# EAGLE design v0.2 (EAGLE 8.4.3)
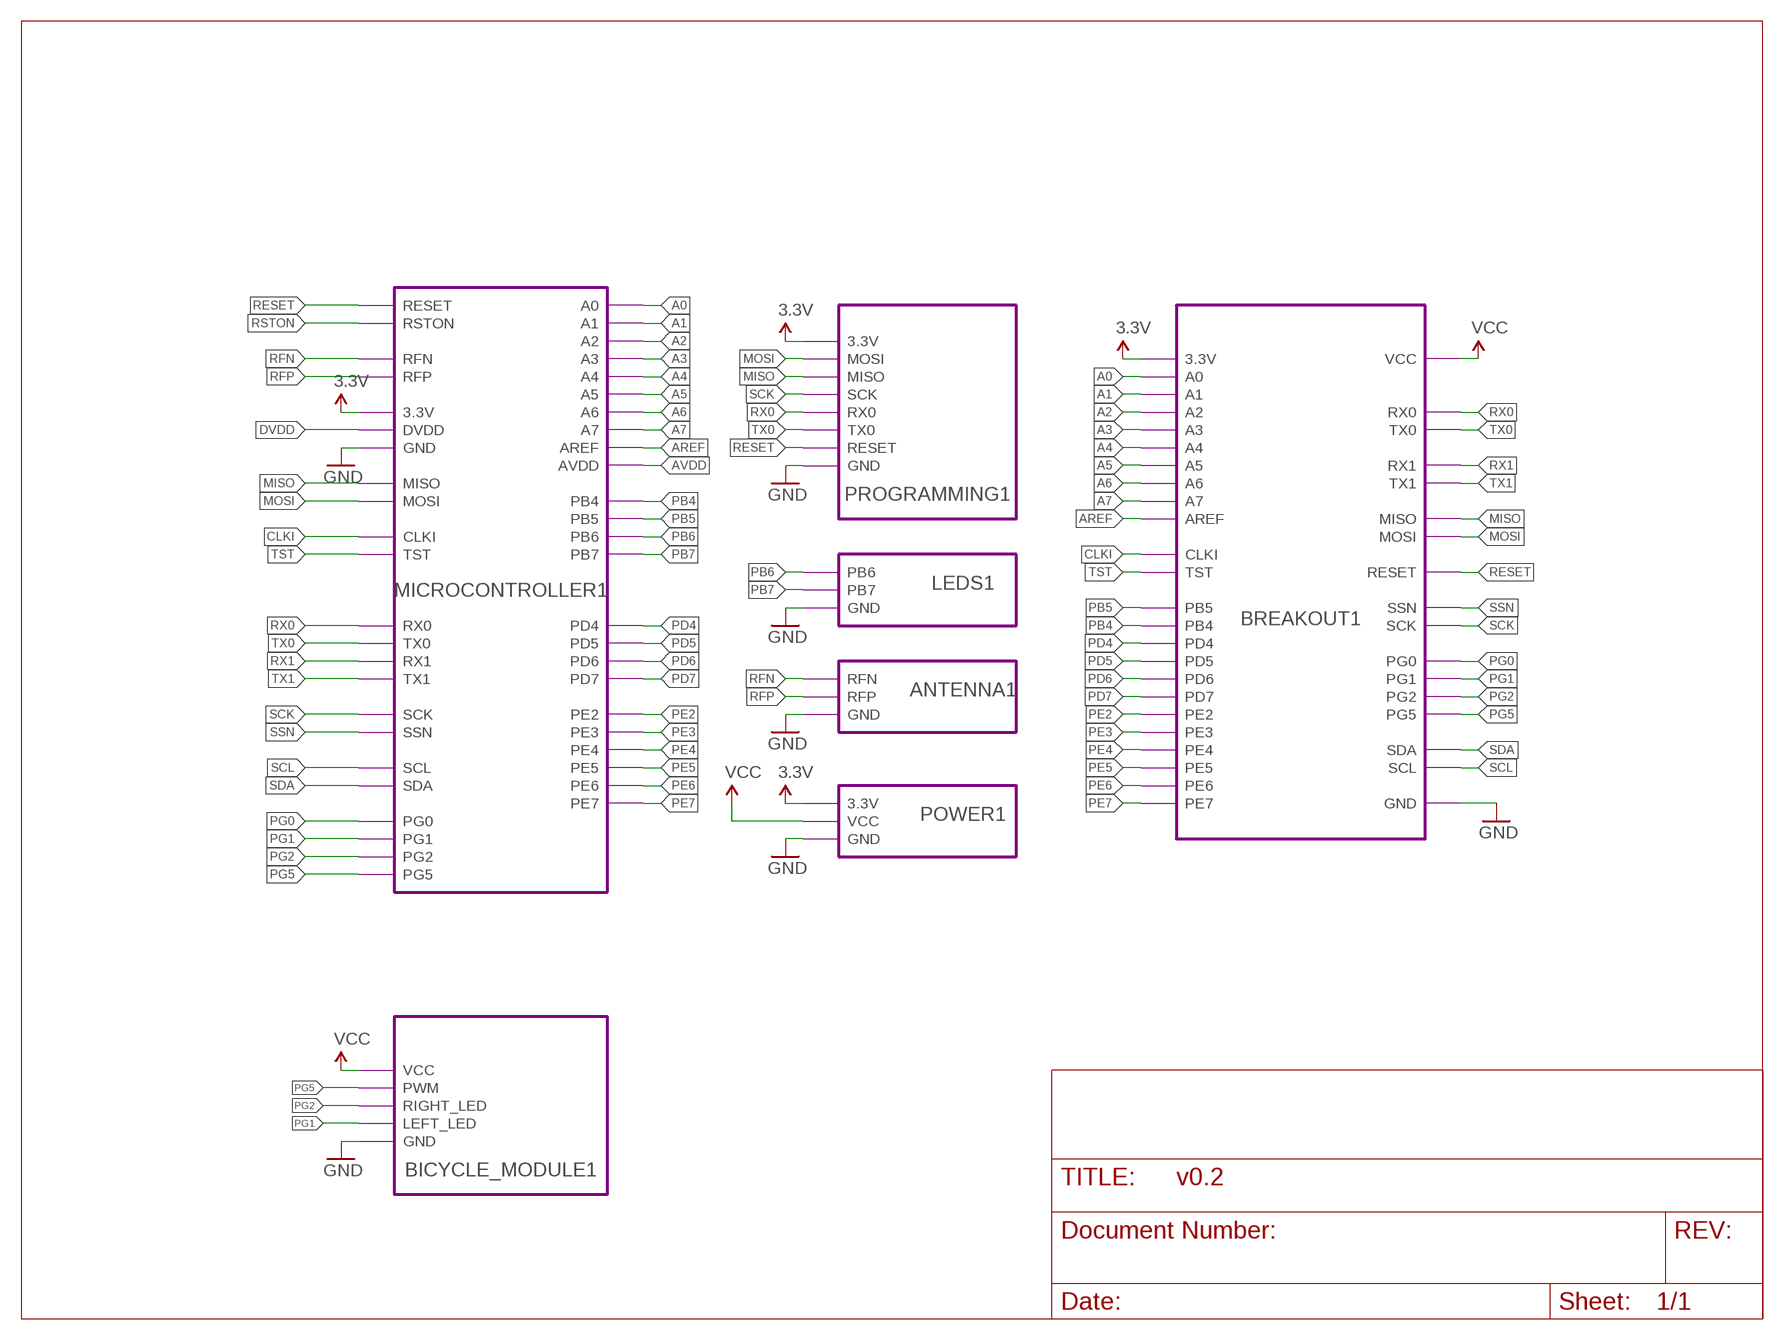
[diagram p0: schematic, sheet 1]

## Module instances
MICROCONTROLLER1 = MICROCONTROLLER
LEDS1 = LEDS
BREAKOUT1 = BREAKOUTS
ANTENNA1 = ANTENNA
POWER1 = POWER
PROGRAMMING1 = PROGRAMMING
BICYCLE_MODULE1 = BICYCLE_MODULE

## Nets
3.3V: port MICROCONTROLLER1.3.3V PROGRAMMING1.3.3V POWER1.3.3V BREAKOUT1.3.3V
A0: port MICROCONTROLLER1.A0 BREAKOUT1.A0
A1: port MICROCONTROLLER1.A1 BREAKOUT1.A1
A2: port MICROCONTROLLER1.A2 BREAKOUT1.A2
A3: port MICROCONTROLLER1.A3 BREAKOUT1.A3
A4: port MICROCONTROLLER1.A4 BREAKOUT1.A4
A5: port MICROCONTROLLER1.A5 BREAKOUT1.A5
A6: port MICROCONTROLLER1.A6 BREAKOUT1.A6
A7: port MICROCONTROLLER1.A7 BREAKOUT1.A7
AREF: port MICROCONTROLLER1.AREF BREAKOUT1.AREF
AVDD: port MICROCONTROLLER1.AVDD
CLKI: port MICROCONTROLLER1.CLKI BREAKOUT1.CLKI
DVDD: port MICROCONTROLLER1.DVDD
GND: port PROGRAMMING1.GND LEDS1.GND ANTENNA1.GND POWER1.GND MICROCONTROLLER1.GND BREAKOUT1.GND BICYCLE_MODULE1.GND
MISO: port PROGRAMMING1.MISO MICROCONTROLLER1.MISO BREAKOUT1.MISO
MOSI: port MICROCONTROLLER1.MOSI PROGRAMMING1.MOSI BREAKOUT1.MOSI
PB4: port MICROCONTROLLER1.PB4 BREAKOUT1.PB4
PB5: port MICROCONTROLLER1.PB5 BREAKOUT1.PB5
PB6: port MICROCONTROLLER1.PB6 LEDS1.PB6
PB7: port MICROCONTROLLER1.PB7 LEDS1.PB7
PD4: port MICROCONTROLLER1.PD4 BREAKOUT1.PD4
PD5: port MICROCONTROLLER1.PD5 BREAKOUT1.PD5
PD6: port MICROCONTROLLER1.PD6 BREAKOUT1.PD6
PD7: port MICROCONTROLLER1.PD7 BREAKOUT1.PD7
PE2: port MICROCONTROLLER1.PE2 BREAKOUT1.PE2
PE3: port MICROCONTROLLER1.PE3 BREAKOUT1.PE3
PE4: port MICROCONTROLLER1.PE4 BREAKOUT1.PE4
PE5: port MICROCONTROLLER1.PE5 BREAKOUT1.PE5
PE6: port MICROCONTROLLER1.PE6 BREAKOUT1.PE6
PE7: port MICROCONTROLLER1.PE7 BREAKOUT1.PE7
PG0: port MICROCONTROLLER1.PG0 BREAKOUT1.PG0
PG1: port MICROCONTROLLER1.PG1 BREAKOUT1.PG1 BICYCLE_MODULE1.LEFT_LED
PG2: port MICROCONTROLLER1.PG2 BREAKOUT1.PG2 BICYCLE_MODULE1.RIGHT_LED
PG5: port MICROCONTROLLER1.PG5 BREAKOUT1.PG5 BICYCLE_MODULE1.PWM
RESET: port MICROCONTROLLER1.RESET PROGRAMMING1.RESET BREAKOUT1.RESET
RFN: port MICROCONTROLLER1.RFN ANTENNA1.RFN
RFP: port MICROCONTROLLER1.RFP ANTENNA1.RFP
RSTON: port MICROCONTROLLER1.RSTON
RX0: port MICROCONTROLLER1.RX0 PROGRAMMING1.RX0 BREAKOUT1.RX0
RX1: port MICROCONTROLLER1.RX1 BREAKOUT1.RX1
SCK: port MICROCONTROLLER1.SCK PROGRAMMING1.SCK BREAKOUT1.SCK
SCL: port MICROCONTROLLER1.SCL BREAKOUT1.SCL
SDA: port MICROCONTROLLER1.SDA BREAKOUT1.SDA
SSN: port MICROCONTROLLER1.SSN BREAKOUT1.SSN
TST: port MICROCONTROLLER1.TST BREAKOUT1.TST
TX0: port MICROCONTROLLER1.TX0 PROGRAMMING1.TX0 BREAKOUT1.TX0
TX1: port MICROCONTROLLER1.TX1 BREAKOUT1.TX1
VCC: port BREAKOUT1.VCC POWER1.VCC BICYCLE_MODULE1.VCC

## Library data of the parts

## Module PROGRAMMING
Ports: RESET(io) SCK(io) MISO(io) MOSI(io) RX0(io) 3.3V(io) TX0(io) GND(io)
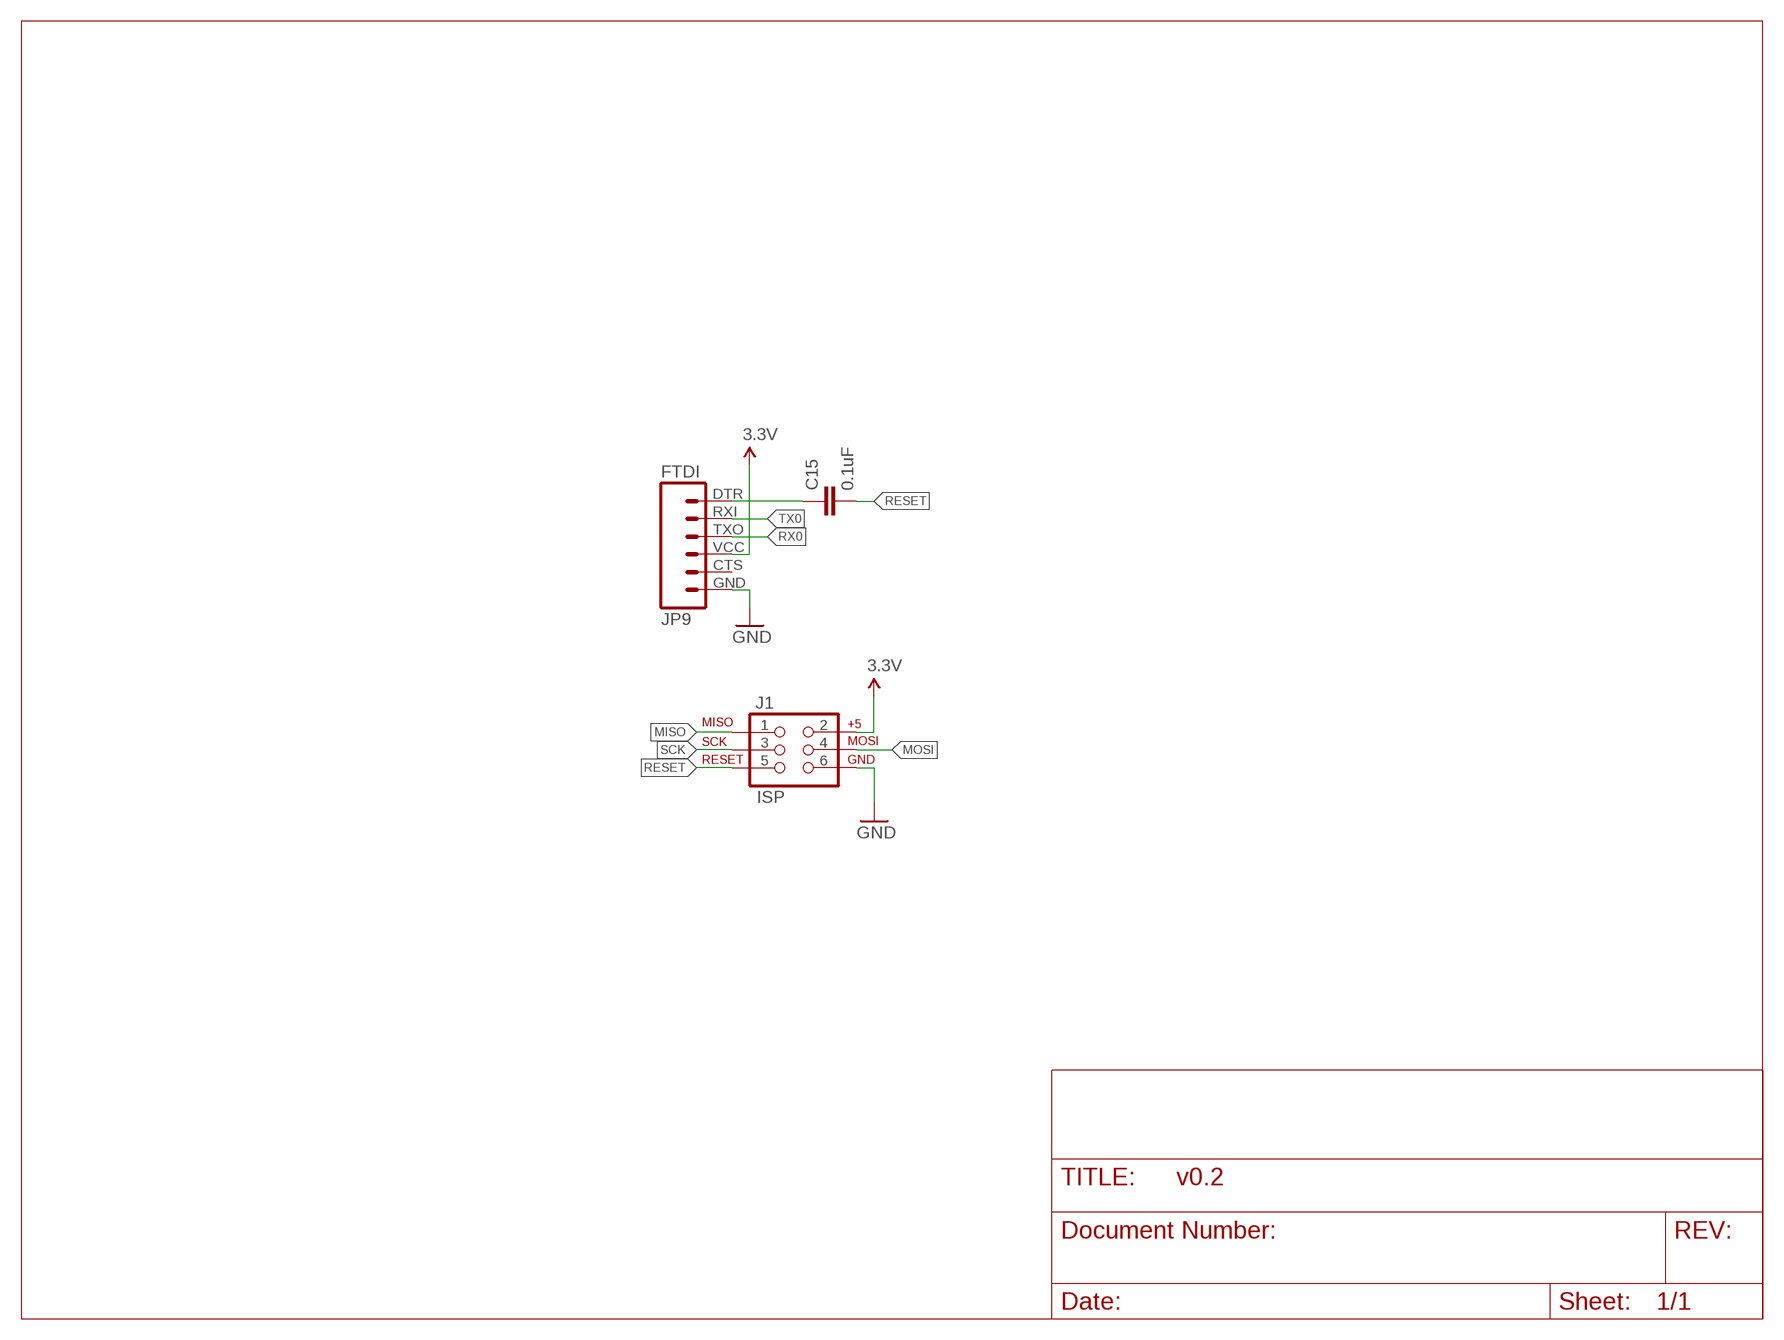
[diagram p1: schematic, module PROGRAMMING, sheet 1]

### Parts
C15  0.1uF  CAP0603-CAP  [0603-CAP]
J1  ISP  AVR_SPI_PRG_6NS  [2X3-NS]
JP9  FTDI  FTDI_BASICPTH  [FTDI_BASIC]

### Nets
3.3V: J1.2 JP9.VCC
DTR: C15.1 JP9.DTR
GND: J1.6 JP9.GND
MISO: J1.1
MOSI: J1.4
RESET: C15.2 J1.5
RX0: JP9.TXO
SCK: J1.3
TX0: JP9.RXI
Unconnected: JP9.CTS

### Library data of the parts
C15 = SparkFun-Passives:CAP: Capacitor Standard 0603 ceramic capacitor, and 0.1" leaded capacitor.
J1 = SparkFun-Connectors:AVR_SPI_PRG_6: AVR ISP 6 Pin This is the reduced ISP connector for AVR programming. Common on Arduino. This footprint will take up less PCB space and can be used with a 10-pin to 6-pin adapter such as SKU: BOB-08508
JP9 = SparkFun-Connectors:FTDI_BASIC: FTDI Basic header with labels

## Module LEDS
Ports: GND(io) PB6(io) PB7(io)
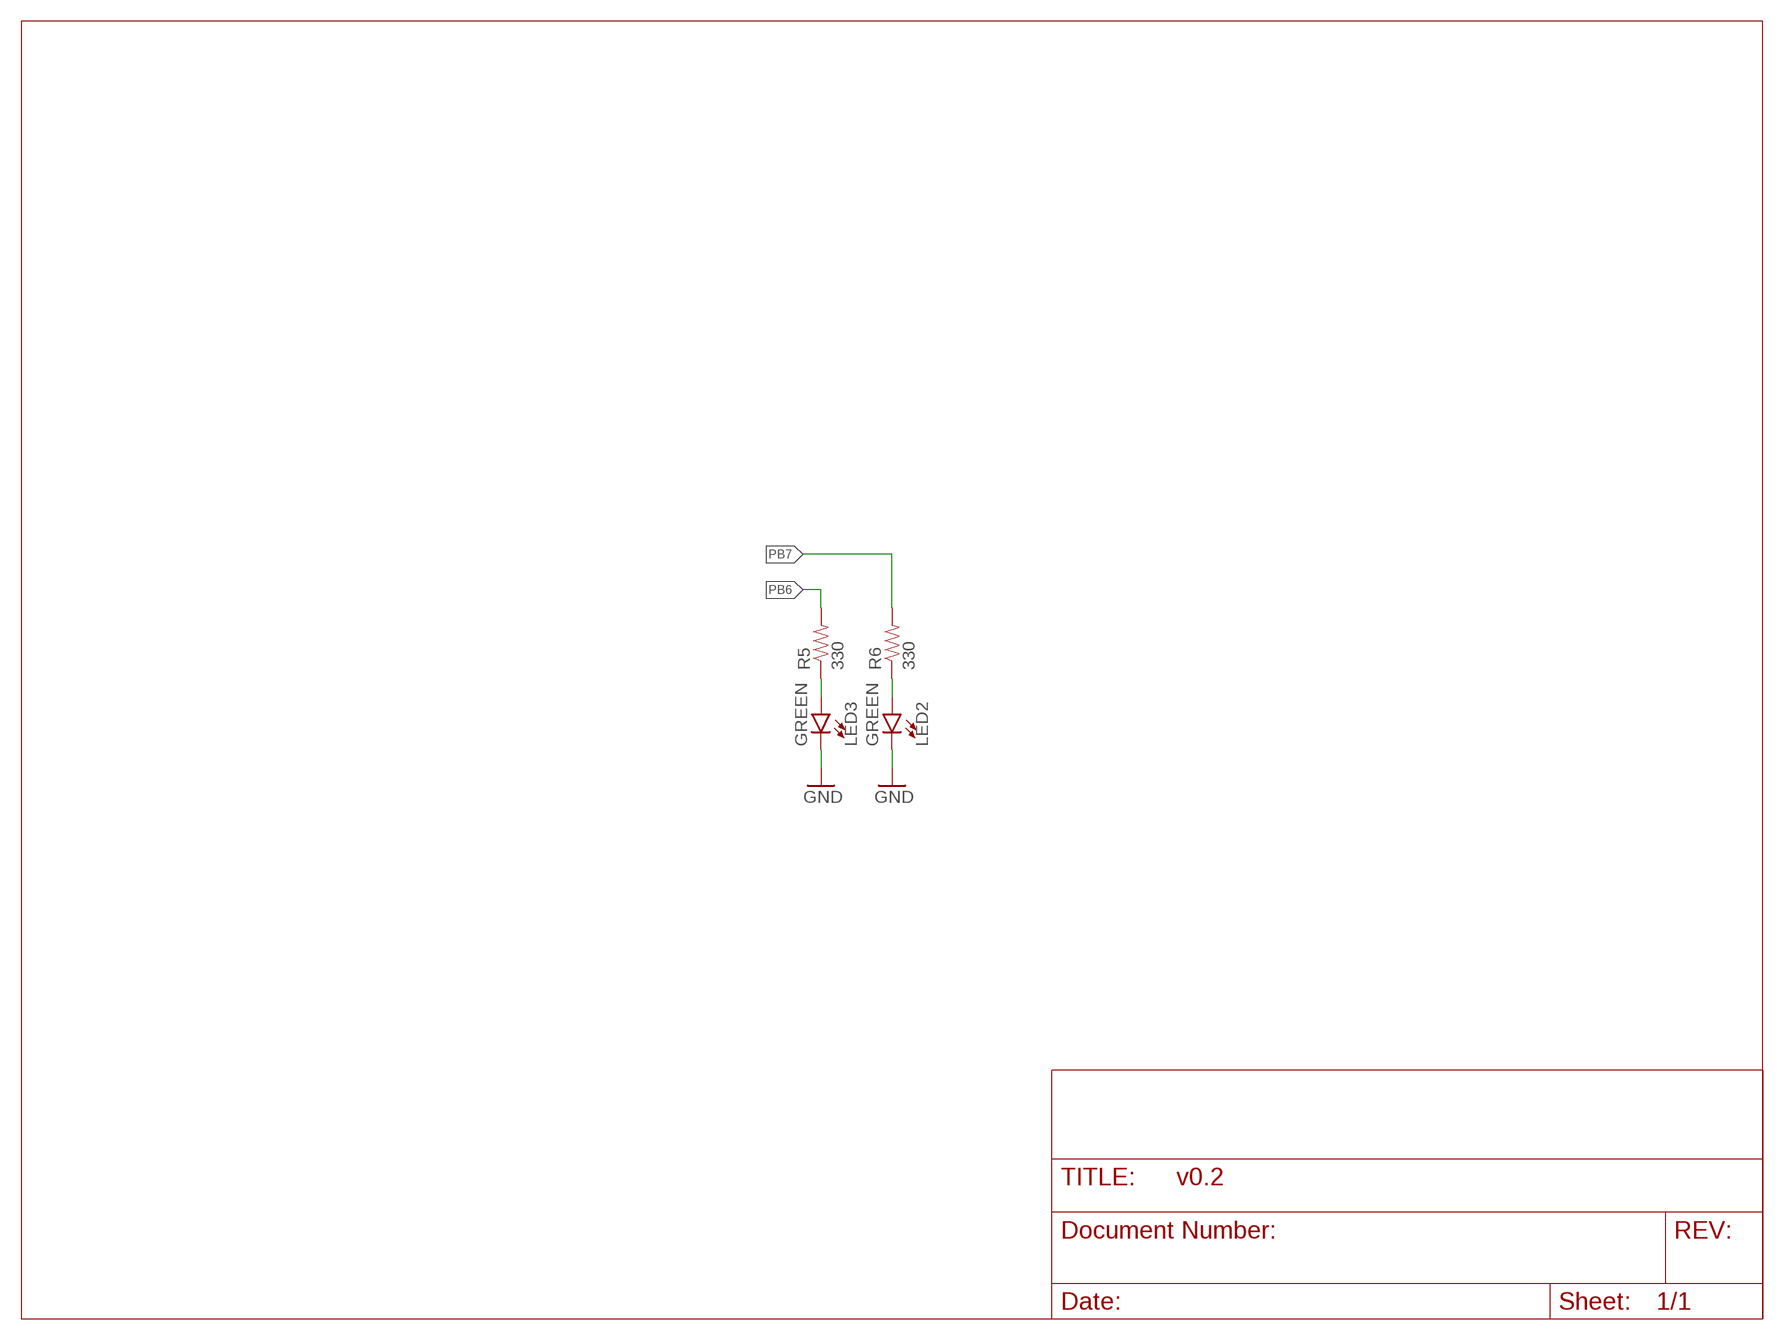
[diagram p2: schematic, module LEDS, sheet 1]

### Parts
LED2  GREEN  LED1206  [LED-1206]
LED3  GREEN  LED1206  [LED-1206]
R5  330  RESISTOR0603-RES  [0603-RES]
R6  330  RESISTOR0603-RES  [0603-RES]

### Nets
GND: LED2.C LED3.C
N$65: LED3.A R5.1
N$66: LED2.A R6.1
PB6: R5.2
PB7: R6.2

### Library data of the parts
LED2 LED3 = SparkFun-LED:LED: LED (Generic) Standard schematic elements and footprints for 5mm, 3mm, 1206, and 0603 sized LEDs. Generic LEDs with no color specified.
R5 R6 = SparkFun:RESISTOR: Resistor Basic schematic elements and footprints for 0603, 1206, and PTH resistors.

## Module POWER
Ports: 3.3V(io) GND(io) VCC(io)
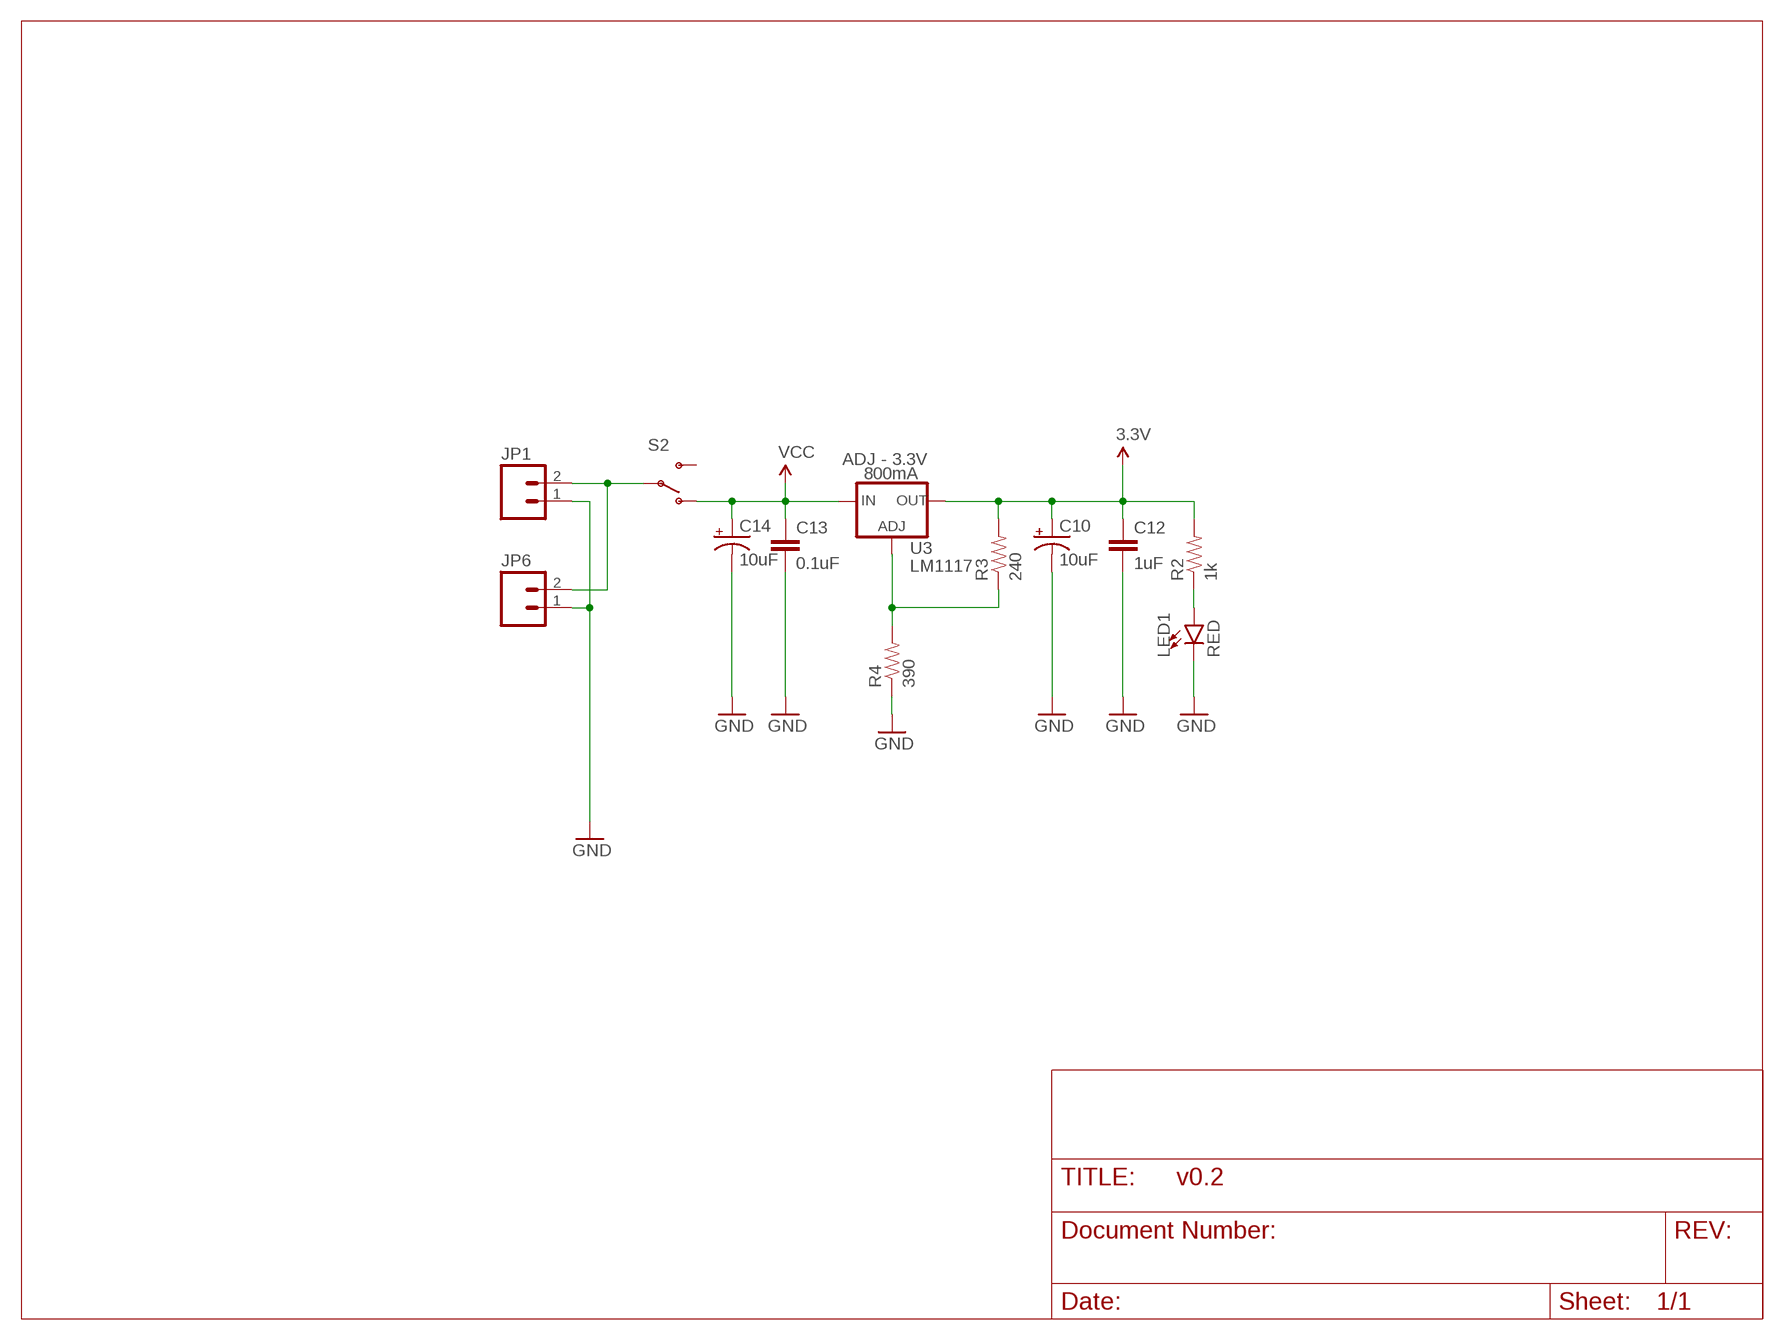
[diagram p3: schematic, module POWER, sheet 1]

### Parts
C10  10uF  CAP_POL1206  [EIA3216]
C12  1uF  CAP0603-CAP  [0603-CAP]
C13  0.1uF  CAP0603-CAP  [0603-CAP]
C14  10uF  CAP_POL1206  [EIA3216]
JP1  M021X02_NO_SILK  [1X02_NO_SILK]
JP6  M02JST-PTH-2  [JST-2-PTH]
LED1  RED  LED1206  [LED-1206]
R2  1k  RESISTOR0603-RES  [0603-RES]
R3  240  RESISTOR0603-RES  [0603-RES]
R4  390  RESISTOR0603-RES  [0603-RES]
S2  SWITCH-SPST-SMD-A  [SWITCH-SPST-SMD-A]
U3  LM1117  V_REG_317SMD  [SOT223]

### Nets
3.3V: C10.A(+) C12.1 R2.2 R3.2 U3.2(OUT)
FB: R3.1 R4.2 U3.1(ADJ)
GND: C10.C(-) C12.2 C13.2 C14.C(-) JP1.1 JP6.1 LED1.C R4.1
N$61: LED1.A R2.1
N$67: JP1.2 JP6.2 S2.2(P)
VCC: C13.1 C14.A(+) S2.1(O) U3.3(IN)
Unconnected: S2.3(S)

### Notes on the sheet
- ADJ - 3.3V
- 800mA

### Library data of the parts
C10 C14 = SparkFun-Passives:CAP_POL: Capacitor Polarized These are standard SMD and PTH capacitors. Normally 10uF, 47uF, and 100uF in electrolytic and tantalum varieties. Always verify the external diameter of the through hole cap, it varies with capacity, voltage, and manufacturer. The EIA devices should be standard.
C12 C13 = SparkFun-Passives:CAP: Capacitor Standard 0603 ceramic capacitor, and 0.1" leaded capacitor.
JP1 JP6 = SparkFun-Connectors:M02: Header 2 Standard 2-pin 0.1" header. Use with straight break away headers (SKU : PRT-00116), right angle break away headers (PRT-00553), swiss pins (PRT-00743), machine pins (PRT-00117), and female headers (PRT-00115). Molex polarized connector foot print use with SKU : PRT-08233 with associated crimp pins and housings.
LED1 = SparkFun-LED:LED: LED (Generic) Standard schematic elements and footprints for 5mm, 3mm, 1206, and 0603 sized LEDs. Generic LEDs with no color specified.
R2 = SparkFun-Passives:RESISTOR: Resistor Basic schematic elements and footprints for 0603, 1206, and PTH resistors.
R3 R4 = SparkFun:RESISTOR: Resistor Basic schematic elements and footprints for 0603, 1206, and PTH resistors.
S2 = SparkFun:SWITCH-SPST: SPST Switch Simple slide switch. Spark Fun Electronics SKU : COM-00102
U3 = SparkFun:V_REG_317: Voltage Regulator Standard LM317 adjustable voltage regulator. AOI (Adjust Output Input). Google 'LM317 Calculator' for easy to use app to get the two resistor values needed. 240/720 for 5V output. 240/390 for 3.3V output. Spark Fun Electronics SKU : COM-00527

## Module ANTENNA
Ports: GND(io) RFN(io) RFP(io)
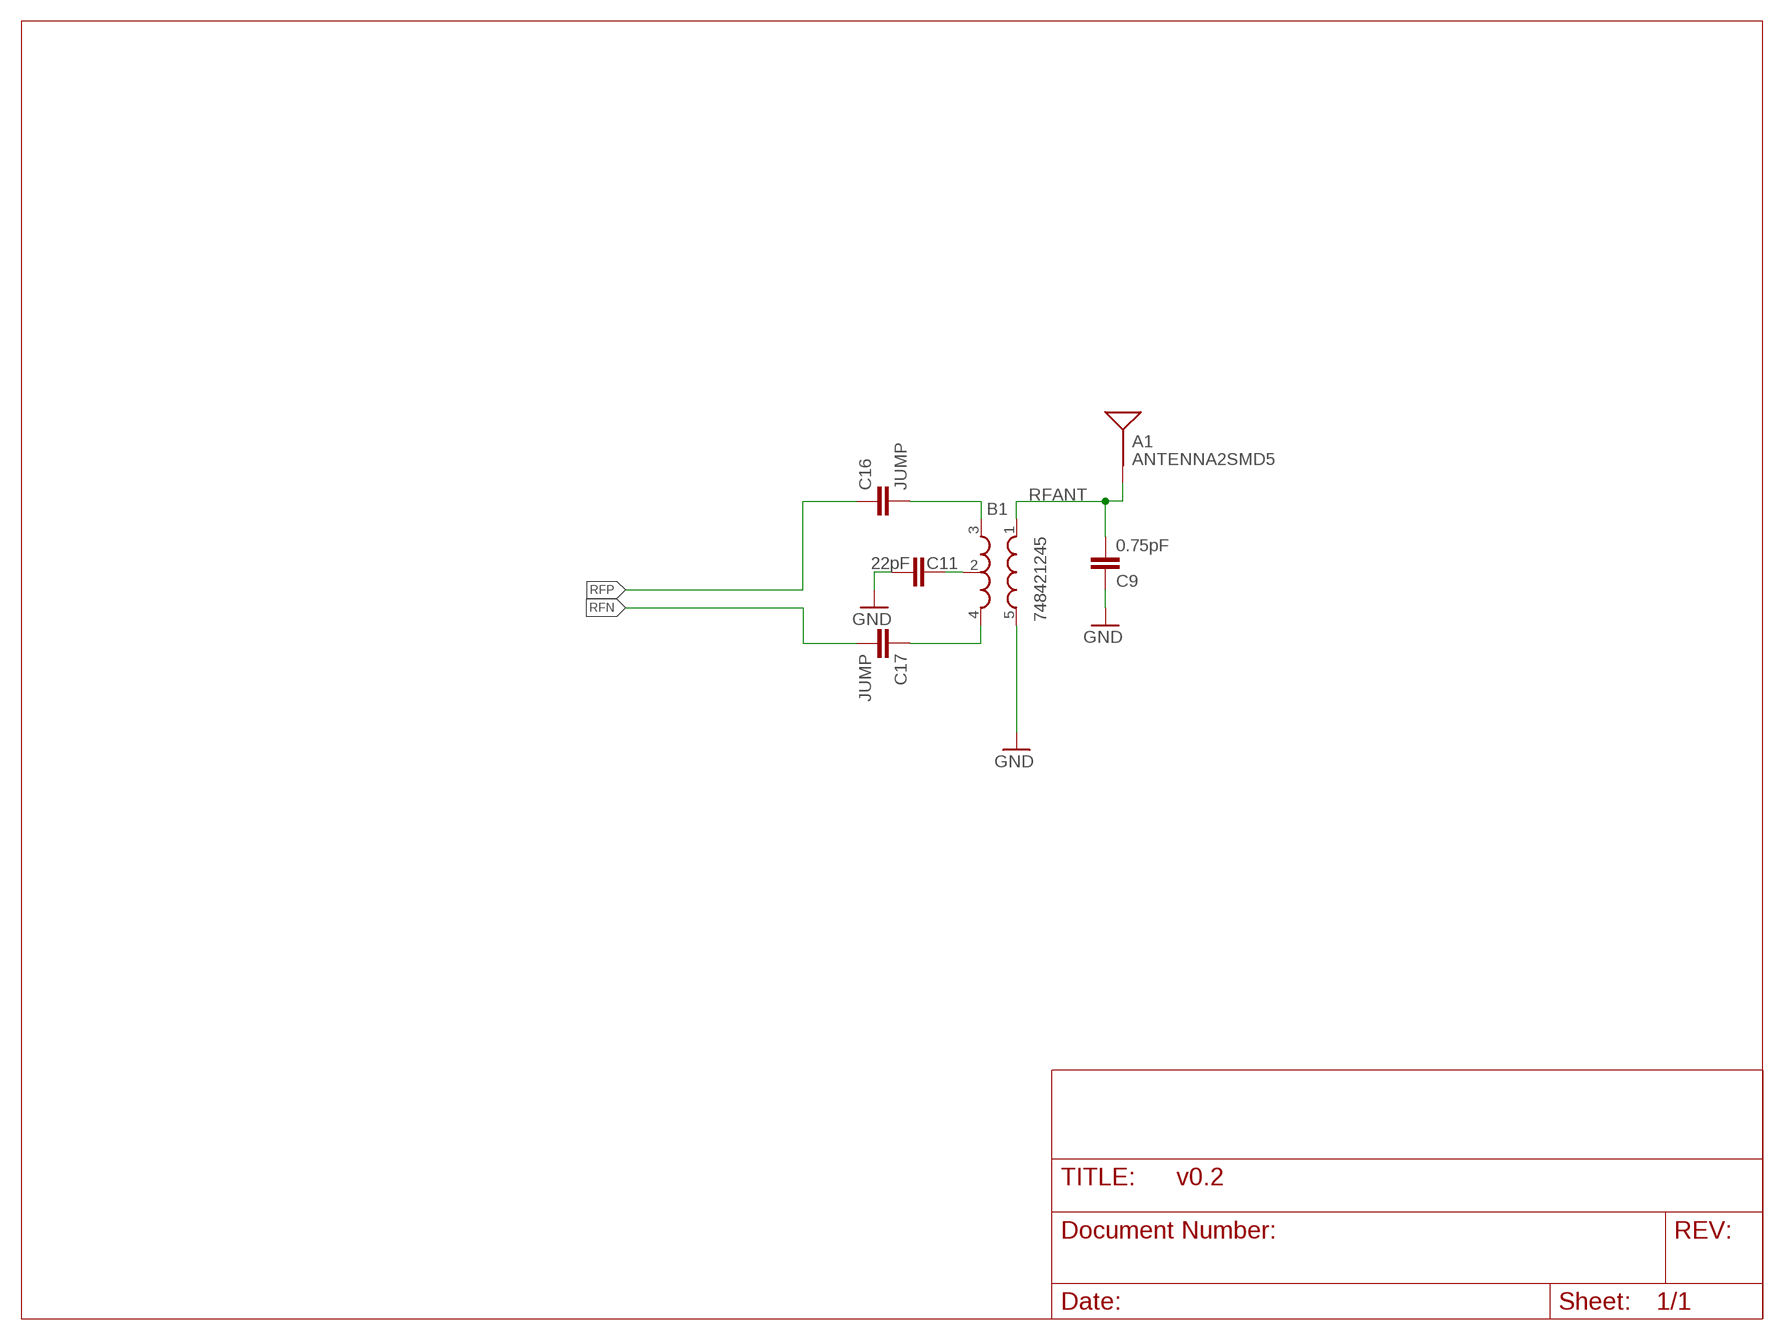
[diagram p4: schematic, module ANTENNA, sheet 1]

### Parts
A1  ANTENNA2SMD5  [ANTENNA-CHIP5]
B1  748421245  BALUN0805  [BALUN-0805]
C9  0.75pF  CAP0603-CAP  [0603-CAP]
C11  22pF  CAP0603-CAP  [0603-CAP]
C16  JUMP  CAP0603-CAP  [0603-CAP]
C17  JUMP  CAP0603-CAP  [0603-CAP]

### Nets
GND: B1.5(GND) C9.1 C11.2
N$62: B1.2(GND) C11.1
N$63: B1.3(OUT1) C16.2
N$64: B1.4(OUT2) C17.1
RFANT: A1.FEED(SIGNAL) B1.1(IN) C9.2
RFN: C17.2
RFP: C16.1

### Library data of the parts
A1 = SparkFun-RF:ANTENNA2: Chip antenna Single endded antenna. Common with smaller chip antennas. CHIP4 package is the GPS Chip Antenna SKU: GPS-08418. CHIP5 package is 2.4GHz chip antenna SKU: WRL-00144.
B1 = SparkFun-RF:BALUN: Balun Transformer to convert an unbalanced signal to a balenced one, or vice-versa. Example Datasheet <http://katalog.we-online.de/pbs/datasheet/748421245.pdf>; PROD_ID: COMP-09637
C9 C11 = SparkFun-Passives:CAP: Capacitor Standard 0603 ceramic capacitor, and 0.1" leaded capacitor.
C16 C17 = SparkFun:CAP: Capacitor Standard 0603 ceramic capacitor, and 0.1" leaded capacitor.

## Module MICROCONTROLLER
Ports: A0(io) A1(io) A2(io) A3(io) A4(io) A5(io) A6(io) A7(io) AREF(io) AVDD(io) PB4(io) PB5(io) PB6(io) PB7(io) PD4(io) PD5(io) PD6(io) PD7(io) PE2(io) PE3(io) PE4(io) PE5(io) PE6(io) PE7(io) PG0(io) PG1(io) PG2(io) PG5(io) RESET(io) RFN(io) RFP(io) DVDD(io) GND(io) 3.3V(io) MISO(io) MOSI(io) CLKI(io) TST(io) RX0(io) TX0(io) RX1(io) TX1(io) SCK(io) SSN(io) RSTON(io) SCL(io) SDA(io)
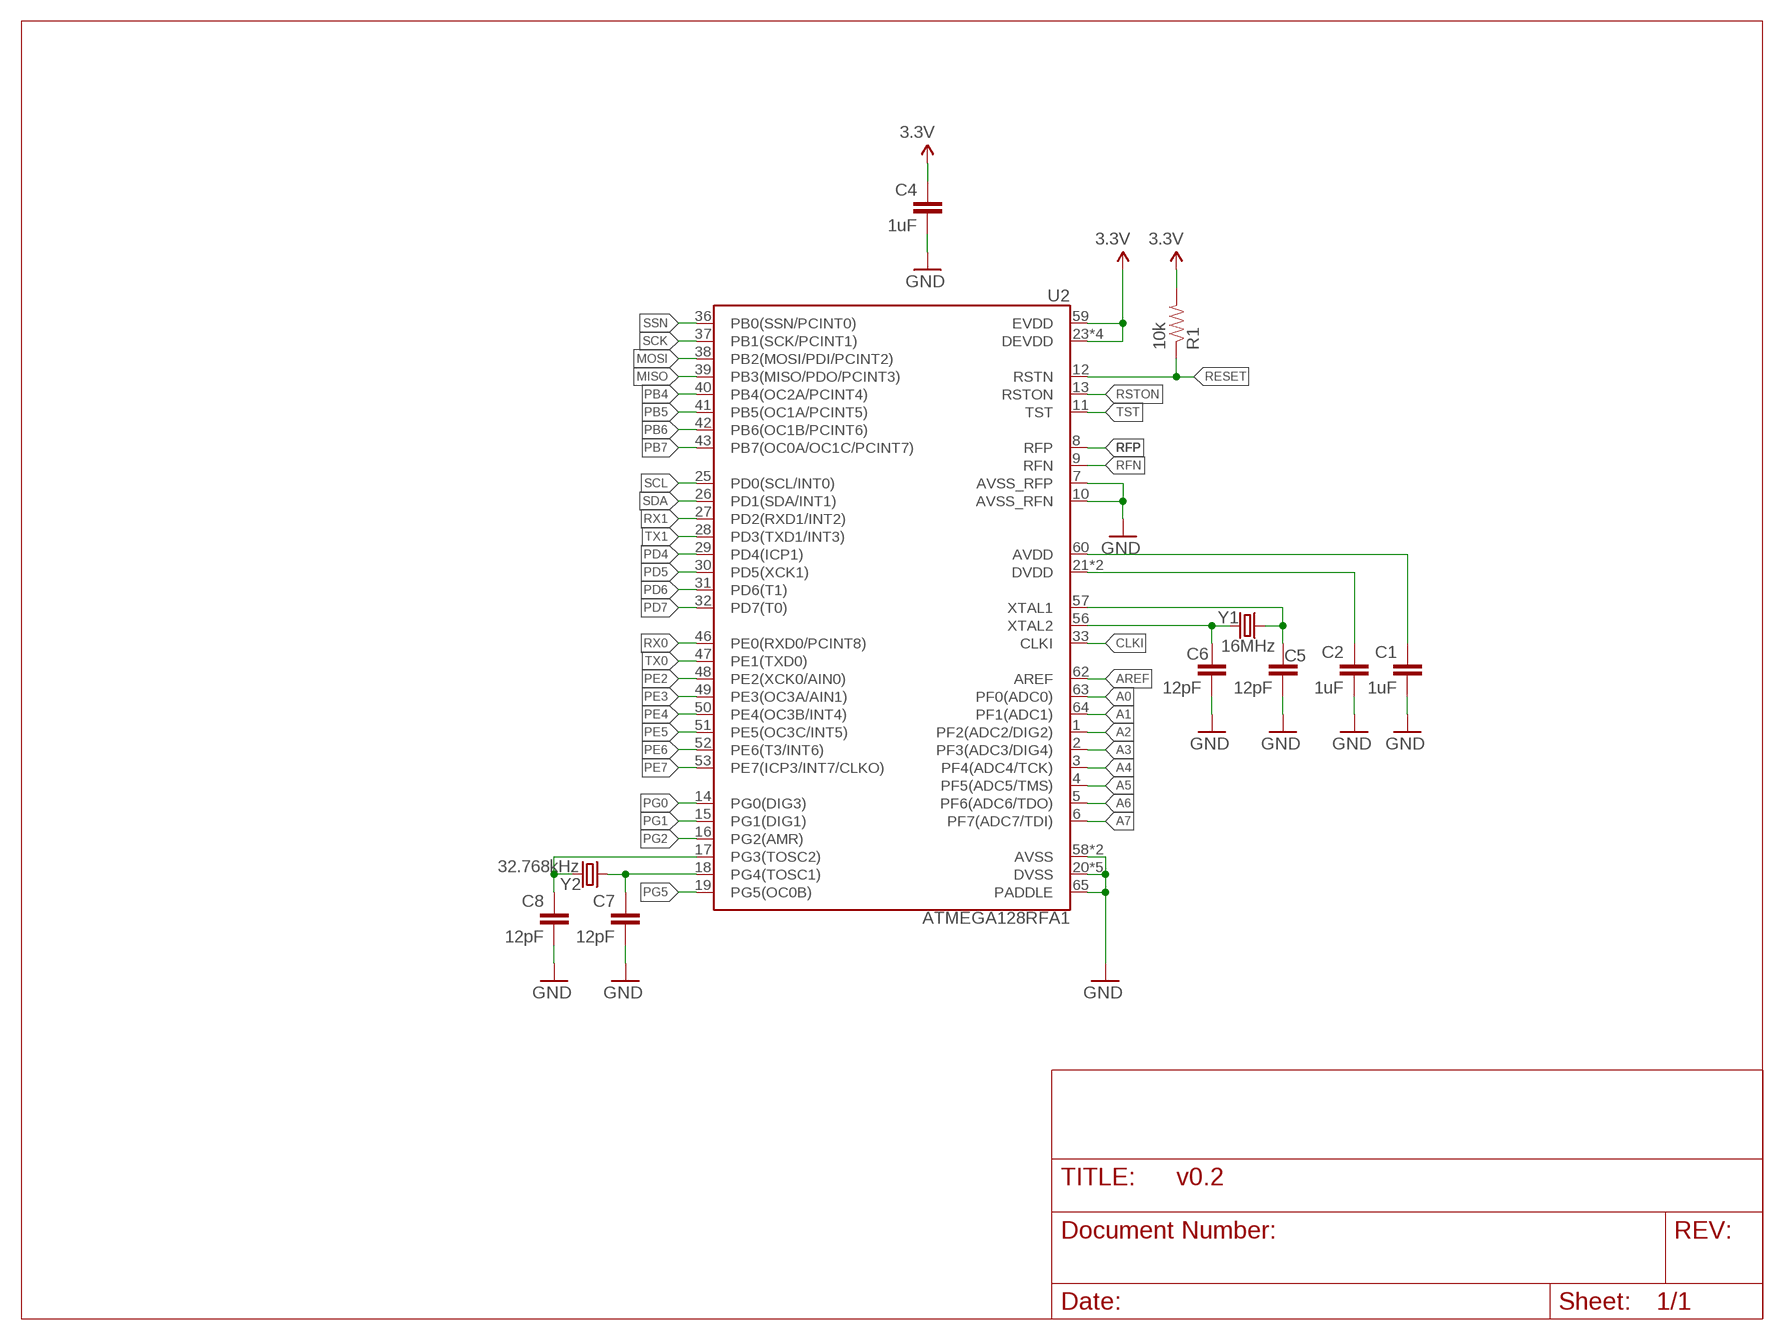
[diagram p5: schematic, module MICROCONTROLLER, sheet 1]

### Parts
C1  1uF  CAP0603-CAP  [0603-CAP]
C2  1uF  CAP0603-CAP  [0603-CAP]
C4  1uF  CAP0603-CAP  [0603-CAP]
C5  12pF  CAP0603-CAP  [0603-CAP]
C6  12pF  CAP0603-CAP  [0603-CAP]
C7  12pF  CAP0603-CAP  [0603-CAP]
C8  12pF  CAP0603-CAP  [0603-CAP]
R1  10k  RESISTOR0603-RES  [0603-RES]
U2  ATMEGA128RFA1  [QFN-64]
Y1  16MHz  CRYSTAL5X3  [CRYSTAL-SMD-5X3]
Y2  32.768kHz  CRYSTAL32-SMD  [CRYSTAL-32KHZ-SMD]

### Nets
3.3V: C4.1 R1.2 U2.23(DEVDD) U2.34(DEVDD) U2.44(DEVDD) U2.54(DEVDD) U2.59(EVDD)
A0: U2.63(PF0(ADC0))
A1: U2.64(PF1(ADC1))
A2: U2.1(PF2(ADC2/DIG2))
A3: U2.2(PF3(ADC3/DIG4))
A4: U2.3(PF4(ADC4/TCK))
A5: U2.4(PF5(ADC5/TMS))
A6: U2.5(PF6(ADC6/TDO))
A7: U2.6(PF7(ADC7/TDI))
AREF: U2.62(AREF)
AVDD: C1.1 U2.60(AVDD)
CLKI: U2.33(CLKI)
DVDD: C2.1 U2.21(DVDD) U2.22(DVDD)
GND: C1.2 C2.2 C4.2 C5.2 C6.2 C7.2 C8.2 U2.7(AVSS_RFP) U2.10(AVSS_RFN) U2.20(DVSS) U2.24(DVSS) U2.35(DVSS) U2.45(DVSS) U2.55(DVSS) U2.58(AVSS) U2.61(AVSS) U2.65(PADDLE)
MISO: U2.39(PB3(MISO/PDO/PCINT3))
MOSI: U2.38(PB2(MOSI/PDI/PCINT2))
N$57: C5.1 U2.57(XTAL1) Y1.3
N$58: C6.1 U2.56(XTAL2) Y1.1
N$59: C7.1 U2.18(PG4(TOSC1)) Y2.X1
N$60: C8.1 U2.17(PG3(TOSC2)) Y2.X2
PB4: U2.40(PB4(OC2A/PCINT4))
PB5: U2.41(PB5(OC1A/PCINT5))
PB6: U2.42(PB6(OC1B/PCINT6))
PB7: U2.43(PB7(OC0A/OC1C/PCINT7))
PD4: U2.29(PD4(ICP1))
PD5: U2.30(PD5(XCK1))
PD6: U2.31(PD6(T1))
PD7: U2.32(PD7(T0))
PE2: U2.48(PE2(XCK0/AIN0))
PE3: U2.49(PE3(OC3A/AIN1))
PE4: U2.50(PE4(OC3B/INT4))
PE5: U2.51(PE5(OC3C/INT5))
PE6: U2.52(PE6(T3/INT6))
PE7: U2.53(PE7(ICP3/INT7/CLKO))
PG0: U2.14(PG0(DIG3))
PG1: U2.15(PG1(DIG1))
PG2: U2.16(PG2(AMR))
PG5: U2.19(PG5(OC0B))
RESET: R1.1 U2.12(RSTN)
RFN: U2.9(RFN)
RFP: U2.8(RFP)
RSTON: U2.13(RSTON)
RX0: U2.46(PE0(RXD0/PCINT8))
RX1: U2.27(PD2(RXD1/INT2))
SCK: U2.37(PB1(SCK/PCINT1))
SCL: U2.25(PD0(SCL/INT0))
SDA: U2.26(PD1(SDA/INT1))
SSN: U2.36(PB0(SSN/PCINT0))
TST: U2.11(TST)
TX0: U2.47(PE1(TXD0))
TX1: U2.28(PD3(TXD1/INT3))

### Library data of the parts
C1 C2 C4-C8 = SparkFun-Passives:CAP: Capacitor Standard 0603 ceramic capacitor, and 0.1" leaded capacitor.
R1 = SparkFun-Passives:RESISTOR: Resistor Basic schematic elements and footprints for 0603, 1206, and PTH resistors.
U2 = SparkFun-DigitalIC:ATMEGA128RFA1: ATmega128RFA1 8-bit AVR Microcontroller with Low Power 2.4GHz Transceiver for ZigBee and IEEE 802.15.4
Y1 Y2 = SparkFun-FreqCtrl:CRYSTAL: Various standard crystals. Proven footprints. Spark Fun Electronics SKU : COM-00534

## Module BREAKOUTS
Ports: 3.3V(io) A0(io) A1(io) A2(io) A3(io) A4(io) A5(io) A6(io) A7(io) AREF(io) CLKI(io) GND(io) MISO(io) MOSI(io) PB4(io) PB5(io) PD4(io) PD5(io) PD6(io) PD7(io) PE2(io) PE3(io) PE4(io) PE5(io) PE6(io) PE7(io) PG0(io) PG1(io) PG2(io) PG5(io) RESET(io) RX0(io) RX1(io) SCK(io) SCL(io) SDA(io) SSN(io) TST(io) TX0(io) TX1(io) VCC(io)
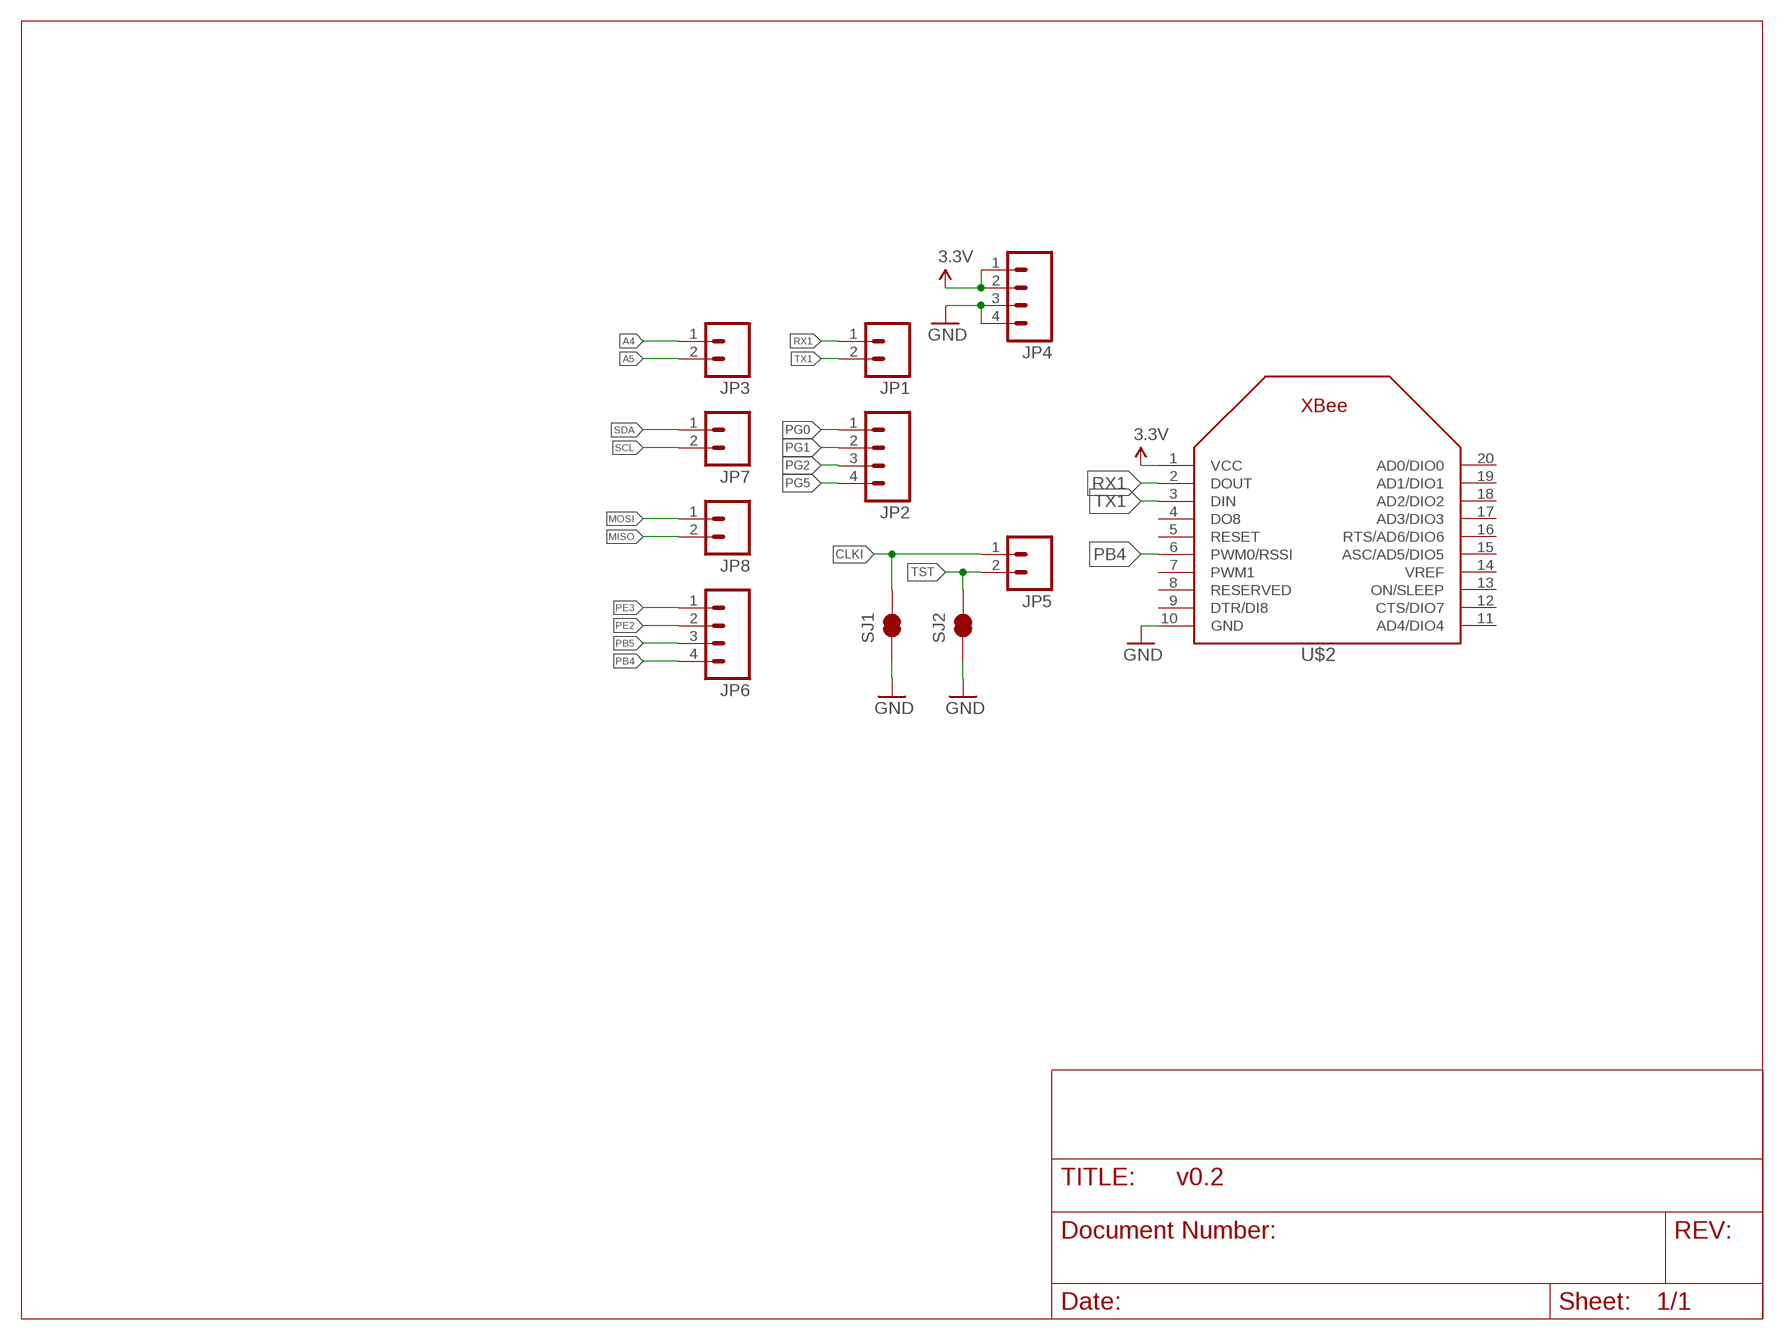
[diagram p6: schematic, module BREAKOUTS, sheet 1]

### Parts
JP1  M021X02_NO_SILK  [1X02_NO_SILK]
JP2  M041X04_NO_SILK  [1X04_NO_SILK]
JP3  M021X02_NO_SILK  [1X02_NO_SILK]
JP4  M041X04_NO_SILK  [1X04_NO_SILK]
JP5  M021X02_NO_SILK  [1X02_NO_SILK]
JP6  M041X04_NO_SILK  [1X04_NO_SILK]
JP7  M021X02_NO_SILK  [1X02_NO_SILK]
JP8  M021X02_NO_SILK  [1X02_NO_SILK]
SJ1  SOLDERJUMPERTRACE  [SJ_2S-TRACE]
SJ2  SOLDERJUMPERTRACE  [SJ_2S-TRACE]
U$2  XBEE  [XBEE]

### Nets
3.3V: JP4.1 JP4.2 U$2.1(VCC)
A4: JP3.1
A5: JP3.2
CLKI: JP5.1 SJ1.2
GND: JP4.3 JP4.4 SJ1.1 SJ2.1 U$2.10(GND)
MISO: JP8.2
MOSI: JP8.1
PB4: JP6.4 U$2.6(PWM0/RSSI)
PB5: JP6.3
PE2: JP6.2
PE3: JP6.1
PG0: JP2.1
PG1: JP2.2
PG2: JP2.3
PG5: JP2.4
RX1: JP1.1 U$2.2(DOUT)
SCL: JP7.2
SDA: JP7.1
TST: JP5.2 SJ2.2
TX1: JP1.2 U$2.3(DIN)
Unconnected: U$2.4(DO8) U$2.5(RESET) U$2.7(PWM1) U$2.8(RESERVED) U$2.9(DTR/DI8) U$2.11(AD4/DIO4) U$2.12(CTS/DIO7) U$2.13(ON/SLEEP) U$2.14(VREF) U$2.15(ASC/AD5/DIO5) U$2.16(RTS/AD6/DIO6) U$2.17(AD3/DIO3) U$2.18(AD2/DIO2) U$2.19(AD1/DIO1) U$2.20(AD0/DIO0)

### Library data of the parts
JP1 JP3 JP5 JP7 JP8 = SparkFun-Connectors:M02: Header 2 Standard 2-pin 0.1" header. Use with straight break away headers (SKU : PRT-00116), right angle break away headers (PRT-00553), swiss pins (PRT-00743), machine pins (PRT-00117), and female headers (PRT-00115). Molex polarized connector foot print use with SKU : PRT-08233 with associated crimp pins and housings.
JP2 JP4 JP6 = SparkFun-Connectors:M04: Header 4 Standard 4-pin 0.1" header. Use with straight break away headers (SKU : PRT-00116), right angle break away headers (PRT-00553), swiss pins (PRT-00743), machine pins (PRT-00117), and female headers (PRT-00115). Molex polarized connector foot print use with SKU : PRT-08231 with associated crimp pins and housings. 1MM SMD Version SKU: PRT-10208
SJ1 SJ2 = SparkFun-Passives:SOLDERJUMPER: Solder Jumper Standard SMD solder jumper. Used to automate production. Two varients : Normally Open and Normally Closed are the same, but have different paste layers. NC will have a large amount of paste and should jumper during reflow.
U$2 = adafruit:XBEE

## Module BICYCLE_MODULE
Ports: VCC(io) PWM(io) GND(io) RIGHT_LED(io) LEFT_LED(io)
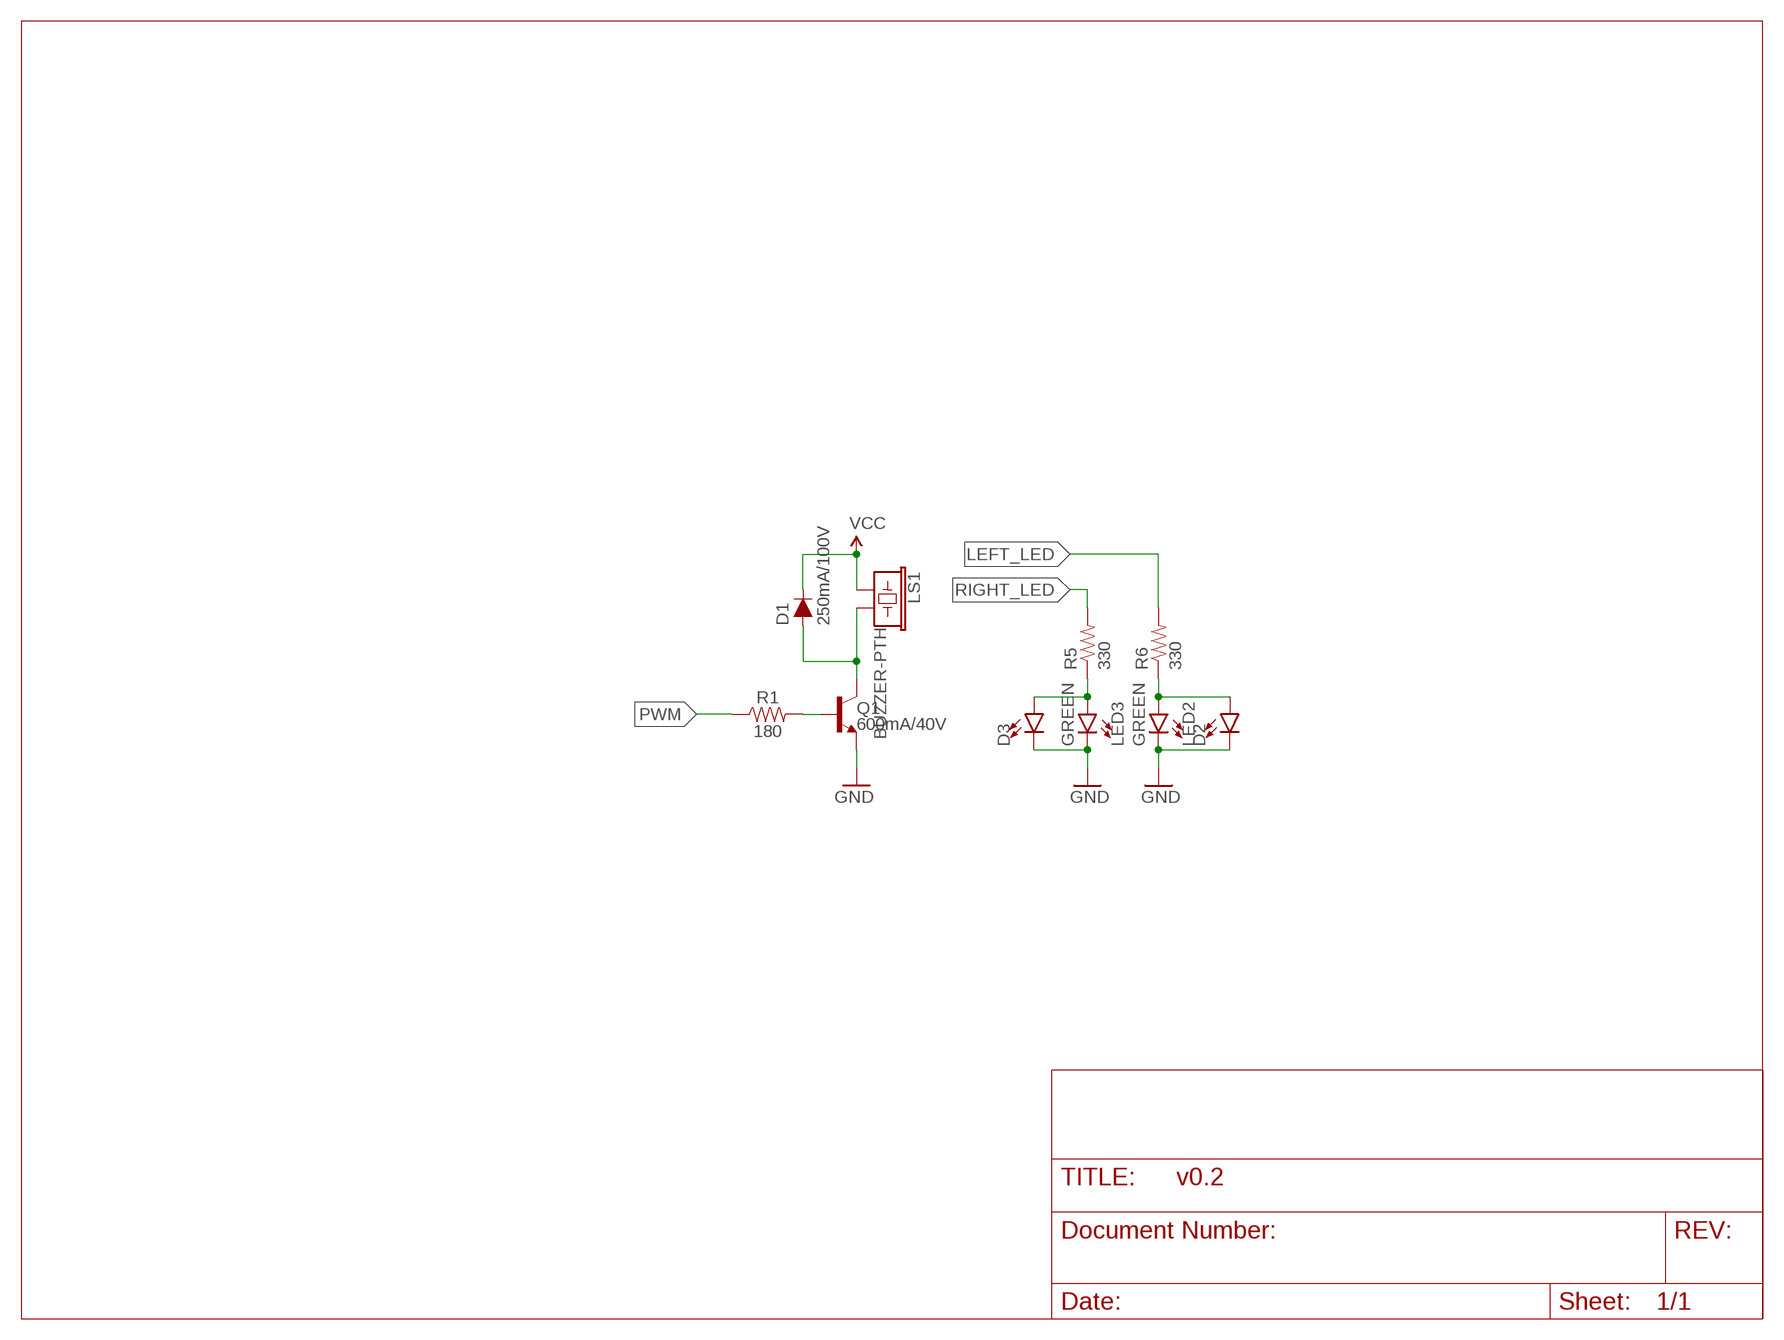
[diagram p7: schematic, module BICYCLE_MODULE, sheet 1]

### Parts
D1  250mA/100V  DIODE-BAS16J  [SOD-323]
D2  LED5MM  [LED_5MM]
D3  LED5MM  [LED_5MM]
LED2  GREEN  LED1206  [LED-1206]
LED3  GREEN  LED1206  [LED-1206]
LS1  BUZZER-PTH  [BUZZER-12MM]
Q1  600mA/40V  TRANS_NPN-P2N2222A  [TO-92]
R1  180  180OHM-0603-1/10W-1%  [0603]
R5  330  RESISTOR0603-RES  [0603-RES]
R6  330  RESISTOR0603-RES  [0603-RES]

### Nets
GND: D2.K(C) D3.K(C) LED2.C LED3.C Q1.3(E)
LEFT_LED: R6.2
N$1: Q1.2(B) R1.2
N$2: D1.A LS1.- Q1.1(C)
N$65: D3.A LED3.A R5.1
N$66: D2.A LED2.A R6.1
PWM: R1.1
RIGHT_LED: R5.2
VCC: D1.C LS1.+

### Library data of the parts
D1 = SparkFun-DiscreteSemi:DIODE: Diode These are standard reverse protection diodes and small signal diodes. SparkFun Products: SparkFun SparkPunk Sound Kit <https://www.sparkfun.com/products/11177> SparkFun ESP8266 Thing <https://www.sparkfun.com/products/13231>; PROD_ID: DIO-09646
D2 D3 LED2 LED3 = SparkFun-LED:LED: LED (Generic) Standard schematic elements and footprints for 5mm, 3mm, 1206, and 0603 sized LEDs. Generic LEDs with no color specified.
LS1 = SparkFun-Electromechanical:BUZZER: Buzzer Small round buzzers that operate around the audible 2kHz range. You can use these as speakers to create simple music or user interfaces. Variant Overview: PTH - Mini Speaker - PC Mount 12mm 2.048kHz <https://www.sparkfun.com/products/7950> PTH_KIT - Mini Speaker - PC Mount 12mm 2.048kHz <https://www.sparkfun.com/products/7950> KIT simplifies soldering by adding stop mask to one side of the pads. PTH_NO_SILK - Mini Speaker - PC Mount 12mm 2.048kHz <https://www.sparkfun.com/products/7950> No silkscreen indicator of buzzer outline. PTH_KIT_NO_SILK - Mini Speaker - PC Mount 12mm 2.048kHz <https://www.sparkfun.com/products/7950> KIT package w/o silkscreen SMD - Buzzer Audio Magnetic (CCV-084B16) SMD buzzer used on, e.g. the LilyPad Buzzer <https://www.sparkfun.com/products/8463> and RFID USB Reader <https://www.sparkfun.com/products/9963>. SMD_KIT - Buzzer Audio Magnetic (CCV-084B16) SMD Buzzer with elongated pins to make soldering easier. Used on the SparkFun Simon Says - Surface Mount Soldering Kit <https://www.sparkfun.com/products/10935>.; PROD_ID: COMP-08253; SF_SKU: COM-07950
Q1 = SparkFun-DiscreteSemi:TRANS_NPN: NPN transistor Current controlled devices typically used to amplify current or used as a switch. BC547 - COM-08928 <http://www.sparkfun.com/products/8928> (TO-92 45V 100mA) (1.Collector 2.Base 3.Emitter) 2N3904 - COM-00521 <http://www.sparkfun.com/products/521> (TO-92 40V 200mA) (1.Emitter 2.Base 3.Collector) P2N2222A - COM-12852 <http://www.sparkfun.com/products/12852> (TO-92 40V 600mA) (1.Collector 2.Base 3.Emitter); PROD_ID: TRANS-09536
R1 = SparkFun-Resistors:180OHM: 180Ω resistor A resistor is a passive two-terminal electrical component that implements electrical resistance as a circuit element. Resistors act to reduce current flow, and, at the same time, act to lower voltage levels within circuits. - Wikipedia; PROD_ID: RES-08788
R5 R6 = SparkFun:RESISTOR: Resistor Basic schematic elements and footprints for 0603, 1206, and PTH resistors.

## Board
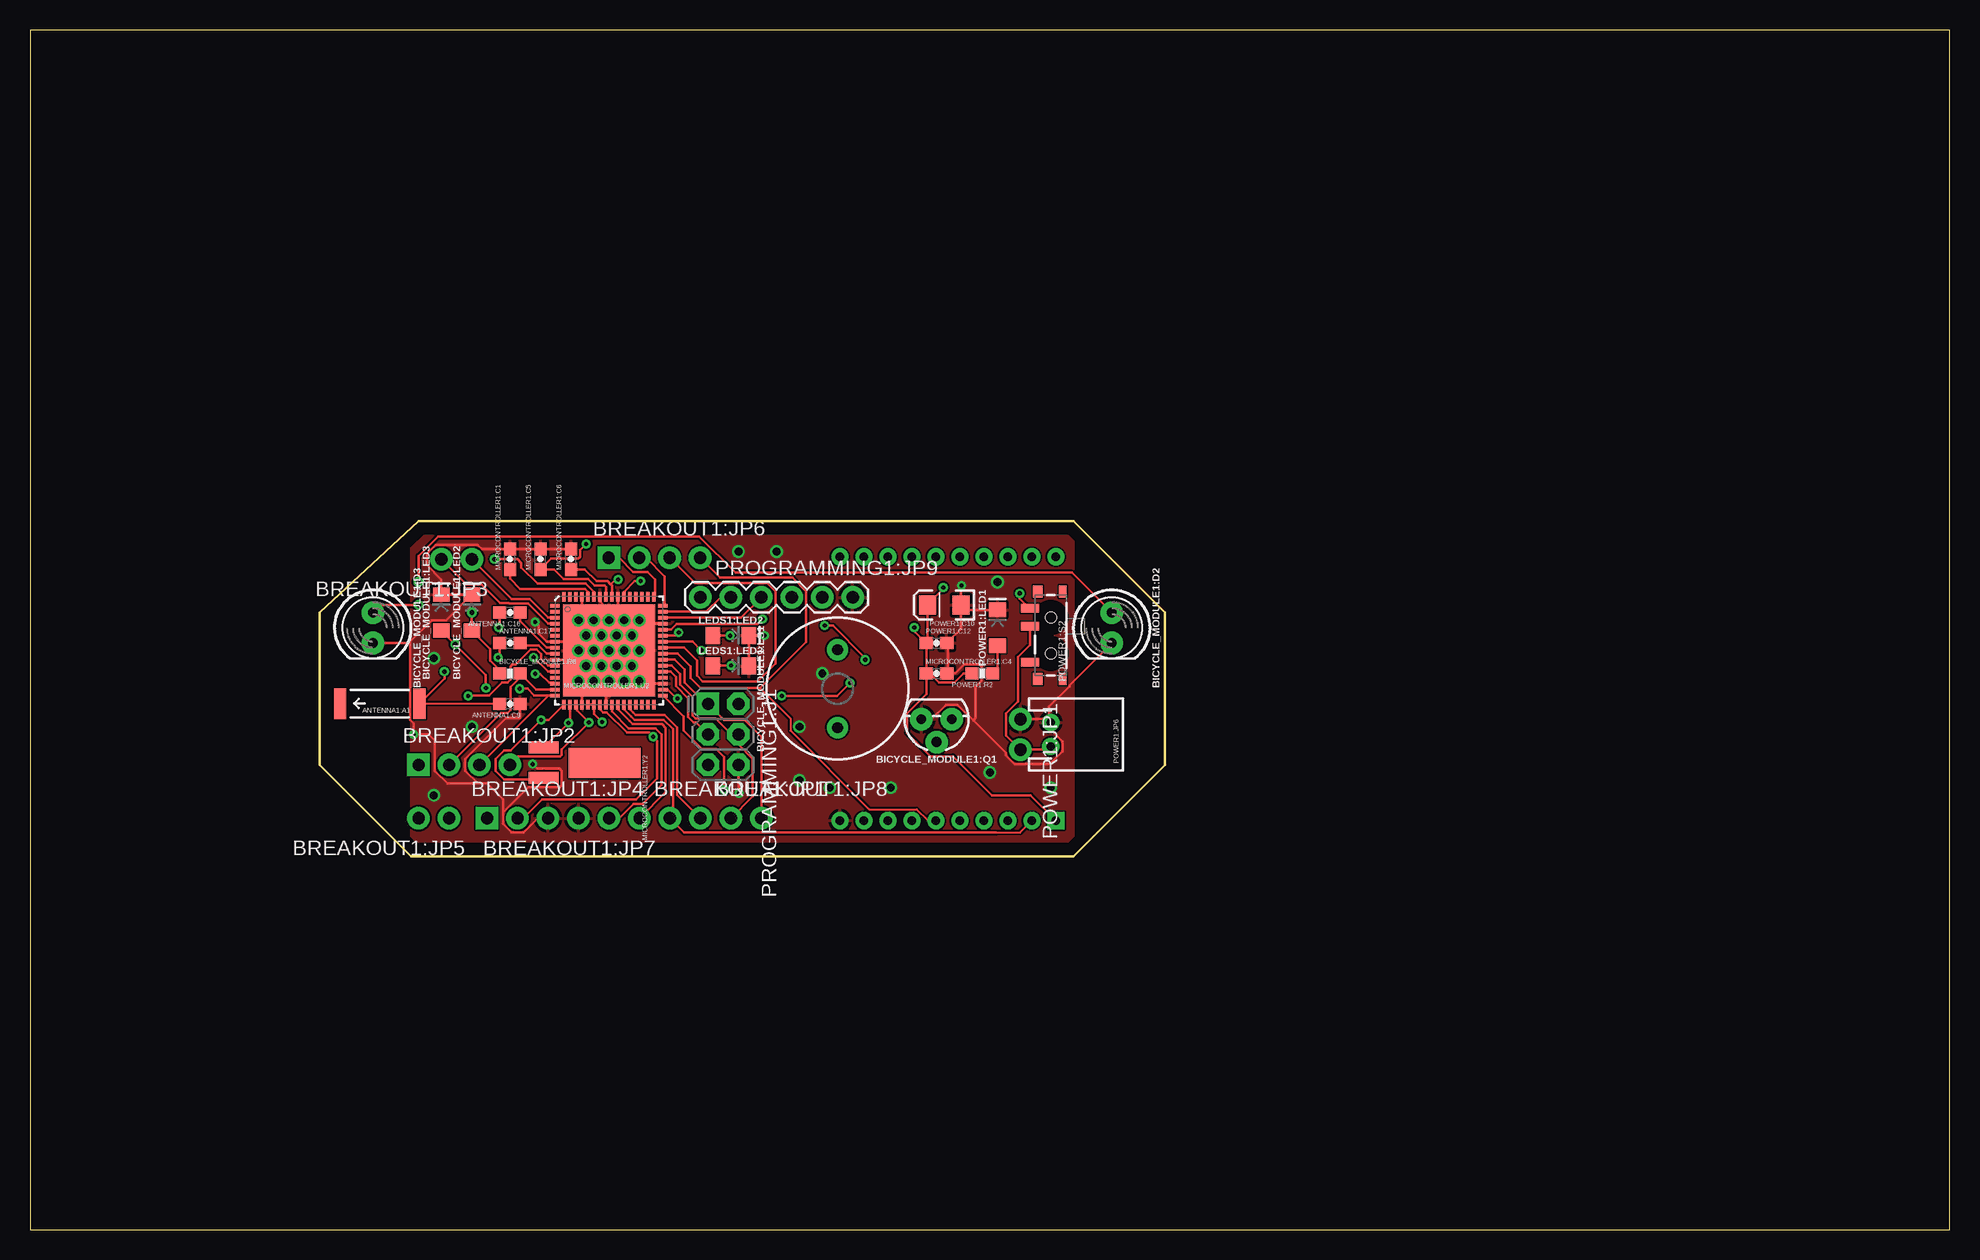
[diagram p8: board, top side]
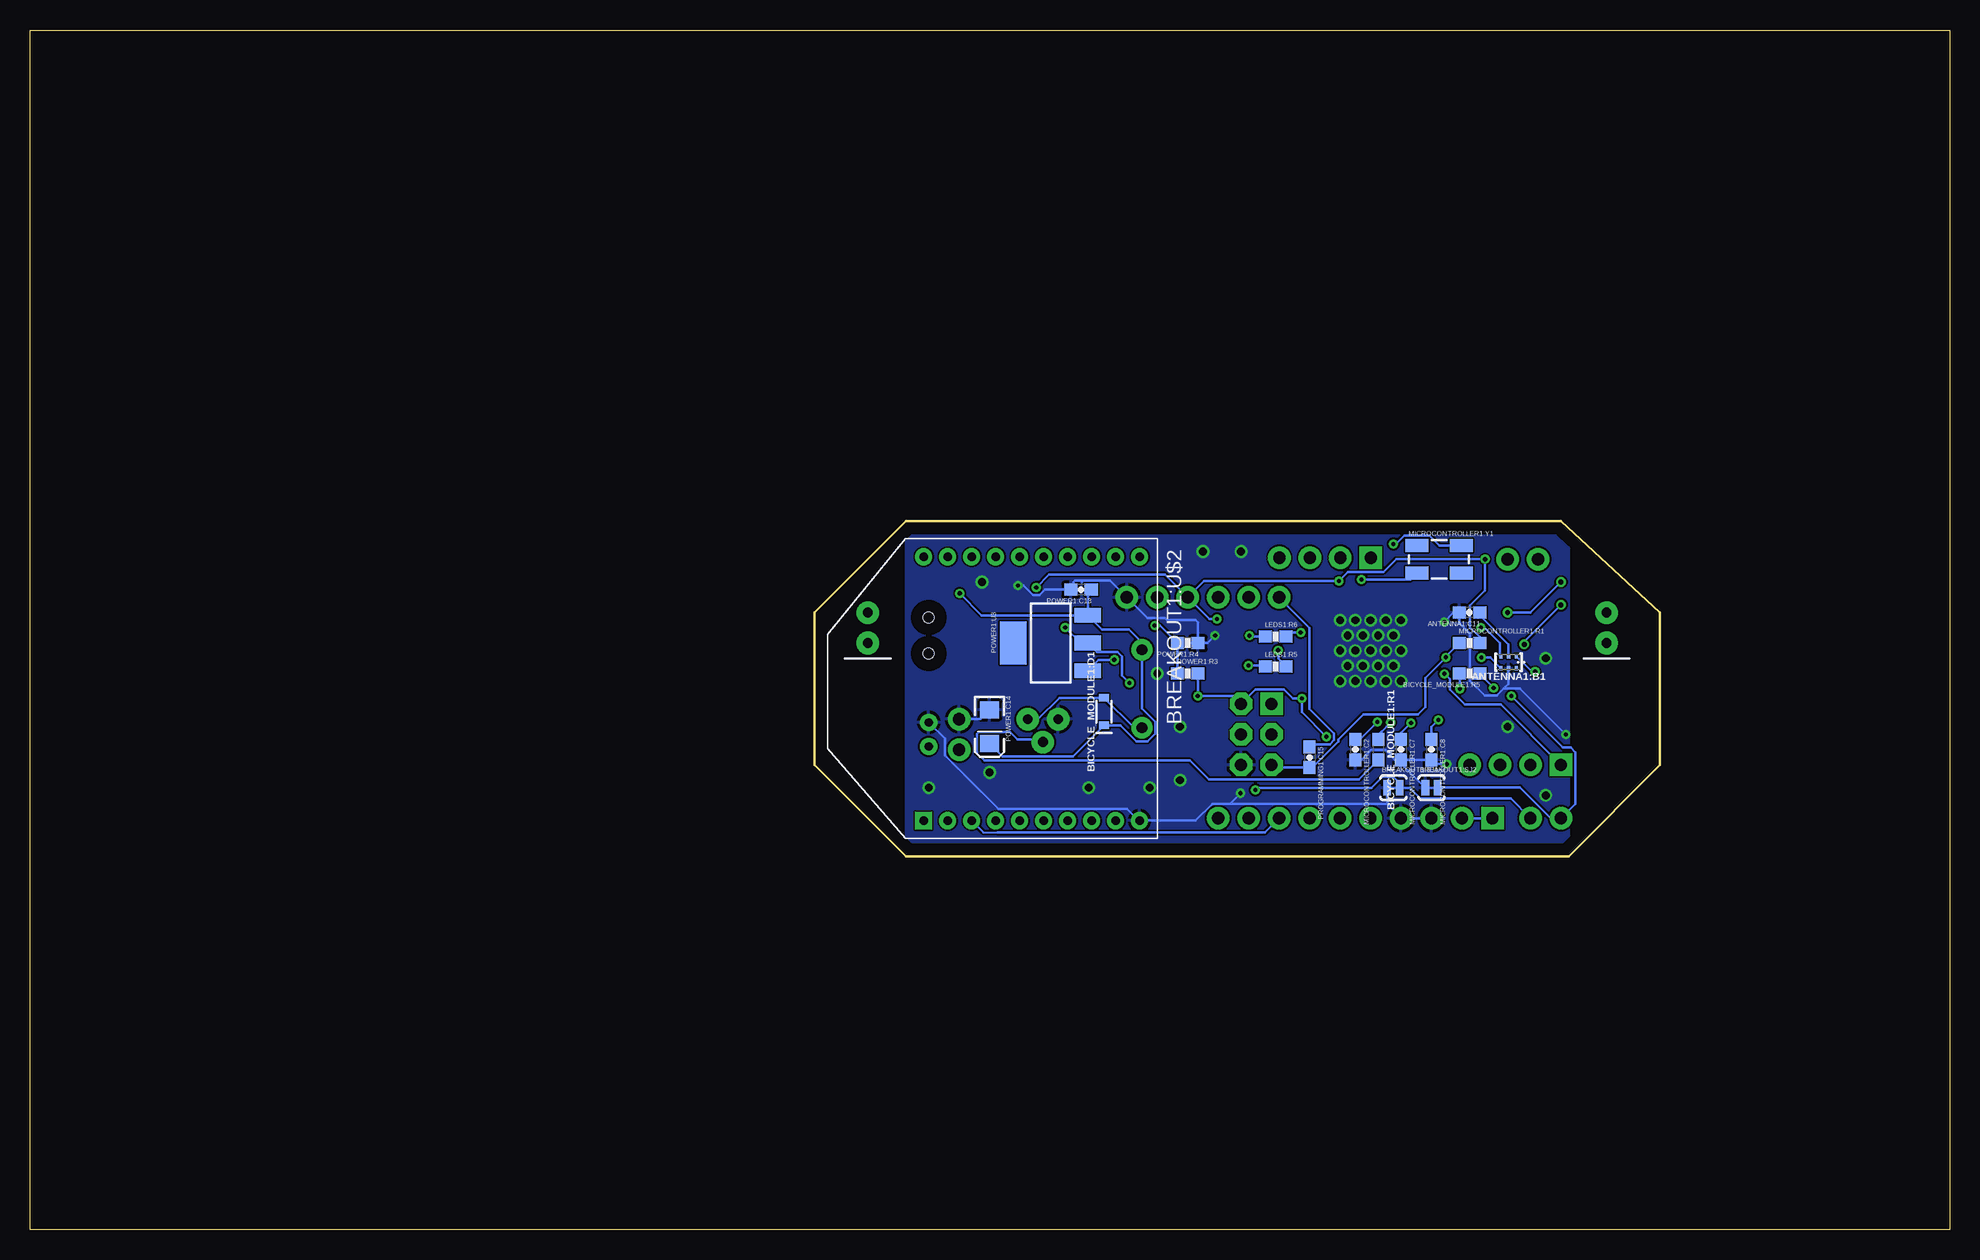
[diagram p9: board, bottom side, seen from below]

Size 160 x 100 mm. Coordinates in mm from the lower left corner, seen from the top.
Outline: 0,0 160,0 160,100 0,100 0,0
Outline: 32.38,59.05 87,59.05 94.61,51.44 94.61,38.73 87,31.11 31.75,31.11 24.13,38.73 24.13,51.44 32.38,59.05
Copper layers (1*16): Top 0.035mm / dielectric 1.5mm / Bottom 0.035mm
Design rules "default": minimum track width 6mil, minimum drill 0.35mm, track to track 6mil, track to pad 6mil, pad to pad 6mil, via to via 6mil, smd to smd 6mil, copper to edge 40mil, drill to drill 6mil, minimum pad ring 10mil, minimum via ring 8mil, stop-mask expansion 4mil, vias tented up to drill 0mil, thermal gap 10mil

### Footprints (pad centres in the part's own frame; a part is rotated, then mirrored left to right if it is on the bottom)
ANTENNA-CHIP5 = smd 1.016 x 2.54: FEED -3.302,0; NC 3.302,0
BALUN-0805 = smd 0.27 x 0.4: 1 -0.65,-0.495; 2 0,-0.495; 3 0.65,-0.495; 4 0.65,0.505; 5 0,0.505; 6 -0.65,0.505
0603-CAP = smd 1.1 x 1: 1 -0.85,0; 2 0.85,0
SOD-323 = smd 0.63 x 0.83: A 1.15,0; C -1.15,0
LED_5MM = drill 0.813 pad 1.88: A -1.27,0; K 1.27,0
LED-1206 = smd 1.2 x 1.4: A -1.5,0; C 1.5,0
BUZZER-12MM = drill 0.9 pad 1.778: + 3.25,0; - -3.25,0
TO-92 = drill 0.813 pad 1.88: 1 -1.27,0; 2 0,1.905; 3 1.27,0
0603 = smd 1.1 x 1: 1 -0.85,0; 2 0.85,0
0603-RES = smd 1.1 x 1: 1 -0.85,0; 2 0.85,0
1X02_NO_SILK = drill 1.016 pad 1.88: 1 0,0; 2 2.54,0
1X04_NO_SILK = drill 1.016 pad 1.88 square: 1 0,0 | drill 1.016 pad 1.88: 2 2.54,0; 3 5.08,0; 4 7.62,0
SJ_2S-TRACE = smd 0.635 x 1.27: 1 -0.508,0; 2 0.508,0
XBEE = drill 0.7 pad 1.422 square: 1 -11,5.5 | drill 0.7 pad 1.422: 2 -11,3.5; 3 -11,1.5; 4 -11,-0.5; 5 -11,-2.5; 6 -11,-4.5; 7 -11,-6.5; 8 -11,-8.5; 9 -11,-10.5; 10 -11,-12.5; 11 11,-12.5; 12 11,-10.5; 13 11,-8.5; 14 11,-6.5; 15 11,-4.5; 16 11,-2.5; 17 11,-0.5; 18 11,1.5; 19 11,3.5; 20 11,5.5
QFN-64 = smd 0.8 x 0.28: 1 -4.5,3.75; 2 -4.5,3.25; 3 -4.5,2.75; 4 -4.5,2.25; 5 -4.5,1.75; 6 -4.5,1.25; 7 -4.5,0.75; 8 -4.5,0.25; 9 -4.5,-0.25; 10 -4.5,-0.75; 11 -4.5,-1.25; 12 -4.5,-1.75; 13 -4.5,-2.25; 14 -4.5,-2.75; 15 -4.5,-3.25; 16 -4.5,-3.75; 33 4.5,-3.75; 34 4.5,-3.25; 35 4.5,-2.75; 36 4.5,-2.25; 37 4.5,-1.75; 38 4.5,-1.25; 39 4.5,-0.75; 40 4.5,-0.25; 41 4.5,0.25; 42 4.5,0.75; 43 4.5,1.25; 44 4.5,1.75; 45 4.5,2.25; 46 4.5,2.75; 47 4.5,3.25; 48 4.5,3.75 | smd 0.28 x 0.8: 17 -3.75,-4.5; 18 -3.25,-4.5; 19 -2.75,-4.5; 20 -2.25,-4.5; 21 -1.75,-4.5; 22 -1.25,-4.5; 23 -0.75,-4.5; 24 -0.25,-4.5; 25 0.25,-4.5; 26 0.75,-4.5; 27 1.25,-4.5; 28 1.75,-4.5; 29 2.25,-4.5; 30 2.75,-4.5; 31 3.25,-4.5; 32 3.75,-4.5; 49 3.75,4.5; 50 3.25,4.5; 51 2.75,4.5; 52 2.25,4.5; 53 1.75,4.5; 54 1.25,4.5; 55 0.75,4.5; 56 0.25,4.5; 57 -0.25,4.5; 58 -0.75,4.5; 59 -1.25,4.5; 60 -1.75,4.5; 61 -2.25,4.5; 62 -2.75,4.5; 63 -3.25,4.5; 64 -3.75,4.5 | smd 7.65 x 7.65: 65 0,0
CRYSTAL-SMD-5X3 = smd 1.9 x 1.1: 1 -1.85,-1.15; 2 1.85,-1.15; 3 1.85,1.15; 4 -1.85,1.15
CRYSTAL-32KHZ-SMD = smd 2.5 x 6: SHEILD 0,5.08 | smd 1 x 2.5: X1 -1.27,0; X2 1.27,0
EIA3216 = smd 1.4 x 1.6: A 1.4,0; C -1.4,0
JST-2-PTH = drill 0.7 pad 1.448: 1 -1,0; 2 1,0
SWITCH-SPST-SMD-A = smd 0.7 x 1.5: 1 -2.25,-1.75; 2 -0.75,-1.75; 3 2.25,-1.75 | smd 1 x 0.6: GND1 -3.65,1; GND3 3.65,1 | smd 1 x 0.8: GND2 -3.65,-1.1; GND4 3.65,-1.1 | hole 0.9: -1.5,0; 1.5,0
SOT223 = smd 1.219 x 2.235: 1 -2.311,-3.099; 2 0,-3.099; 3 2.311,-3.099 | smd 3.6 x 2.2: 4 0,3.099
2X3-NS = drill 1.016 pad 1.88 square: 1 -2.54,-1.27 | drill 1.016 pad 1.88 octagon: 2 -2.54,1.27; 3 0,-1.27; 4 0,1.27; 5 2.54,-1.27; 6 2.54,1.27
FTDI_BASIC = drill 1.016 pad 1.88: CTS 10.16,0; DTR 0,0; GND 12.7,0; RXI 2.54,0; TXO 5.08,0; VCC 7.62,0

### Placement (x,y rotation side)
ANTENNA1:A1  ANTENNA2SMD5  [ANTENNA-CHIP5]  29.16,43.84 180 top
ANTENNA1:B1  748421245  [BALUN-0805]  36.75,47.29 180 bottom
ANTENNA1:C9  0.75pF  [0603-CAP]  40.01,43.81 180 top
ANTENNA1:C11  22pF  [0603-CAP]  40.01,51.44 180 bottom
ANTENNA1:C16  JUMP  [0603-CAP]  40.01,51.44 180 top
ANTENNA1:C17  JUMP  [0603-CAP]  40.01,48.9 0 top
BICYCLE_MODULE1:D1  250mA/100V  [SOD-323]  70.48,43.18 90 bottom
BICYCLE_MODULE1:D2  [LED_5MM]  90.17,50.16 270 top
BICYCLE_MODULE1:D3  [LED_5MM]  28.57,50.16 270 top
BICYCLE_MODULE1:LED2  GREEN  [LED-1206]  36.83,51.44 90 top
BICYCLE_MODULE1:LED3  GREEN  [LED-1206]  34.29,51.44 90 top
BICYCLE_MODULE1:LS1  BUZZER-PTH  [BUZZER-12MM]  67.31,45.09 90 top
BICYCLE_MODULE1:Q1  600mA/40V  [TO-92]  75.56,42.55 180 top
BICYCLE_MODULE1:R1  180  [0603]  47.62,40.01 270 bottom
BICYCLE_MODULE1:R5  330  [0603-RES]  40.01,46.35 180 bottom
BICYCLE_MODULE1:R6  330  [0603-RES]  40.01,46.35 0 top
BREAKOUT1:JP1  [1X02_NO_SILK]  53.34,34.29 0 top
BREAKOUT1:JP2  [1X04_NO_SILK]  32.38,38.73 0 top
BREAKOUT1:JP3  [1X02_NO_SILK]  36.83,55.88 180 top
BREAKOUT1:JP4  [1X04_NO_SILK]  38.1,34.29 0 top
BREAKOUT1:JP5  [1X02_NO_SILK]  34.92,34.29 180 top
BREAKOUT1:JP6  [1X04_NO_SILK]  48.23,56.01 0 top
BREAKOUT1:JP7  [1X02_NO_SILK]  50.8,34.29 180 top
BREAKOUT1:JP8  [1X02_NO_SILK]  58.42,34.29 0 top
BREAKOUT1:SJ1  [SJ_2S-TRACE]  46.35,36.83 0 bottom
BREAKOUT1:SJ2  [SJ_2S-TRACE]  43.18,36.83 0 bottom
BREAKOUT1:U$2  XBEE  [XBEE]  80.01,45.09 90 bottom
LEDS1:LED2  GREEN  [LED-1206]  58.42,49.53 0 top
LEDS1:LED3  GREEN  [LED-1206]  58.42,46.99 0 top
LEDS1:R5  330  [0603-RES]  56.16,46.94 0 bottom
LEDS1:R6  330  [0603-RES]  56.16,49.43 0 bottom
MICROCONTROLLER1:C1  1uF  [0603-CAP]  40.01,55.88 90 top
MICROCONTROLLER1:C2  1uF  [0603-CAP]  49.53,40.01 270 bottom
MICROCONTROLLER1:C4  1uF  [0603-CAP]  75.56,46.35 0 top
MICROCONTROLLER1:C5  12pF  [0603-CAP]  42.55,55.88 90 top
MICROCONTROLLER1:C6  12pF  [0603-CAP]  45.09,55.88 90 top
MICROCONTROLLER1:C7  12pF  [0603-CAP]  45.72,40.01 270 bottom
MICROCONTROLLER1:C8  12pF  [0603-CAP]  43.18,40.01 270 bottom
MICROCONTROLLER1:R1  10k  [0603-RES]  40.01,48.9 0 bottom
MICROCONTROLLER1:U2  ATMEGA128RFA1  [QFN-64]  48.26,48.26 0 top
MICROCONTROLLER1:Y1  16MHz  [CRYSTAL-SMD-5X3]  42.55,55.88 0 bottom
MICROCONTROLLER1:Y2  32.768kHz  [CRYSTAL-32KHZ-SMD]  42.82,38.91 270 top
POWER1:C10  10uF  [EIA3216]  76.2,52.07 180 top
POWER1:C12  1uF  [0603-CAP]  75.56,48.9 0 top
POWER1:C13  0.1uF  [0603-CAP]  72.39,53.34 180 bottom
POWER1:C14  10uF  [EIA3216]  80.01,41.91 270 bottom
POWER1:JP1  [1X02_NO_SILK]  82.55,42.55 270 top
POWER1:JP6  [JST-2-PTH]  85.09,41.27 270 top
POWER1:LED1  RED  [LED-1206]  80.64,50.16 90 top
POWER1:R2  1k  [0603-RES]  79.38,46.35 180 top
POWER1:R3  240  [0603-RES]  63.5,46.35 0 bottom
POWER1:R4  390  [0603-RES]  63.5,48.9 180 bottom
POWER1:S2  [SWITCH-SPST-SMD-A]  85.09,49.53 270 top
POWER1:U3  LM1117  [SOT223]  74.93,48.9 90 bottom
PROGRAMMING1:C15  0.1uF  [0603-CAP]  53.34,39.37 270 bottom
PROGRAMMING1:J1  ISP  [2X3-NS]  57.78,41.27 270 top
PROGRAMMING1:JP9  FTDI  [FTDI_BASIC]  55.88,52.7 0 top

### Tracks (layer width: path | path; a pad name or v marks a point on that pad's centre or on a via)
3.3V  (via drill 0.35)
  Top 0.203: 74.72,48.84 POWER1:C12.1 74.8,48.98 POWER1:C10.A 76.12,53.39 v76.12,53.52 | MICROCONTROLLER1:C4.1 74.72,48.84 | MICROCONTROLLER1:C4.1 75.01,46.35 75.76,45.6 77.07,45.6 77.82,46.35 POWER1:R2.2 | v73.71,50.19 73.71,49.85 74.72,48.84 | v68.35,45.57 67.26,44.48 v62.66,44.48 | v53.97,44.27 53.89,44.27 53.16,45.01 MICROCONTROLLER1:U2.34 | v38.71,55.88 40.64,55.88 40.96,55.56 40.96,55.21 42.3,53.87 46.3,53.87 47.01,53.16 MICROCONTROLLER1:U2.59 | v50.9,54.05 50.4,54.05 49.51,53.16 MICROCONTROLLER1:U2.54 | MICROCONTROLLER1:U2.44 53.43,50.01 53.91,50.48 60.64,50.48 v61.06,50.9 | MICROCONTROLLER1:C4.1 74.72,44.65 73.1,43.04 73.1,41.42 75.07,39.45 76.94,39.45 80.19,36.2 83.4,36.2 BREAKOUT1:U$2.1 | BREAKOUT1:JP4.2 41.1,34.29 42.67,35.87 50.52,35.87 52.27,37.62 52.27,40.74 v51.93,41.08 51.59,41.42 49.77,41.42 48.08,43.11 47.77,43.11 47.51,43.36 MICROCONTROLLER1:U2.23
  Bottom 0.203: v73.71,50.19 72.42,48.9 POWER1:U3.2 71.07,48.13 69.36,48.13 68.99,47.76 68.99,46.2 v68.35,45.57 | v62.65,44.49 v62.66,44.48 | PROGRAMMING1:JP9.VCC 61.7,50.9 v61.06,50.9 | v51.93,41.08 53.97,43.13 v53.97,44.27 54.74,44.27 55.47,45.01 57.86,45.01 PROGRAMMING1:J1.2 59.73,44.49 v62.65,44.49 | MICROCONTROLLER1:R1.2 39.16,49.39 39.96,50.19 39.96,52.04 38.71,53.29 v38.71,55.88 46.12,55.88 47.19,54.81 50.14,54.81 v50.9,54.05 62.15,54.05 PROGRAMMING1:JP9.VCC | BREAKOUT1:JP4.2 BREAKOUT1:JP4.1 | POWER1:R3.2 v62.65,44.49 | PROGRAMMING1:JP9.VCC 65.38,54.59 75.06,54.59 v76.12,53.52
A4
  Top 0.203: BREAKOUT1:JP3.1 40.16,52.55 41.66,52.55 43.19,51.01 MICROCONTROLLER1:U2.3
A5
  Top 0.203: BREAKOUT1:JP3.2 36.38,53.79 37.63,53.79 39.18,52.25 39.9,52.25 39.96,52.19 41.51,52.19 43.19,50.51 MICROCONTROLLER1:U2.4
ANTENNA1:N$62
  Bottom 0.203: ANTENNA1:C11.1 39.16,51.17 36.75,48.77 ANTENNA1:B1.2
ANTENNA1:N$63  (via drill 0.35)
  Top 0.203: v39.06,50.19 39.16,50.28 ANTENNA1:C16.2
  Bottom 0.203: ANTENNA1:B1.3 37.47,47.85 37.47,48.9 38.76,50.19 v39.06,50.19
ANTENNA1:N$64  (via drill 0.35)
  Top 0.203: v39.01,47.68 39.16,47.82 ANTENNA1:C17.1
  Bottom 0.203: ANTENNA1:B1.4 38.29,47.68 v39.01,47.68
ANTENNA1:RFANT  (via drill 0.35)
  Top 0.203: 34.42,46.38 v34.54,46.51 34.54,45.92 ANTENNA1:A1.FEED ANTENNA1:C9.2
  Bottom 0.203: ANTENNA1:B1.1 34.82,46.51 v34.54,46.51
AVDD
  Top 0.203: MICROCONTROLLER1:C1.1 40.01,54.28 40.87,53.41 46.26,53.41 46.51,53.16 MICROCONTROLLER1:U2.60
BICYCLE_MODULE1:N$1
  Bottom 0.203: BICYCLE_MODULE1:R1.2 49.24,37.54 61.75,37.54 63.3,39.09 80.45,39.09 81.06,39.7 81.06,41.31 80.92,41.46 78.29,41.46 77.7,40.87 75.79,40.87 BICYCLE_MODULE1:Q1.2
BICYCLE_MODULE1:N$2
  Bottom 0.203: BICYCLE_MODULE1:LS1.- 67.99,41.84 BICYCLE_MODULE1:D1.A 74.2,44.33 75.98,42.55 BICYCLE_MODULE1:Q1.1
BICYCLE_MODULE1:N$65  (via drill 0.35, 0.4)
  Top 0.203: BICYCLE_MODULE1:LED3.A v35.45,48.78 38,46.23 v38,45.14 | BICYCLE_MODULE1:D3.A 29.21,52.07 v32.38,52.07
  Bottom 0.203: v38,45.14 39.16,46.29 BICYCLE_MODULE1:R5.1 | v32.38,52.07 35.45,49.01 v35.45,48.78
BICYCLE_MODULE1:N$66  (via drill 0.4)
  Top 0.203: BICYCLE_MODULE1:R6.1 39.16,46.64 38.35,47.45 38.35,48.41 BICYCLE_MODULE1:LED2.A v36.83,51.44 | BICYCLE_MODULE1:D2.A 86.85,54.76 58.79,54.76 55.77,57.78 34,57.78 32.38,56.17 v32.38,53.98
  Bottom 0.203: v32.38,53.98 34.92,51.44 v36.83,51.44
CLKI  (via drill 0.35)
  Top 0.203: MICROCONTROLLER1:U2.33 54.5,42.77 54.5,41.6 56.02,40.08 57.19,40.08 57.86,39.41 v57.86,36.65
  Bottom 0.203: v57.86,36.65 57.68,36.83 48.17,36.83 47.29,37.72 46.36,37.72 45.62,36.98 45.62,36.83 45.09,36.83 | 45.09,36.83 45,36.83 44.11,35.94 36.58,35.94 BREAKOUT1:JP5.1 | BREAKOUT1:SJ1.2 45.09,36.83
DVDD  (via drill 0.35)
  Top 0.203: MICROCONTROLLER1:U2.21 MICROCONTROLLER1:U2.22 47.01,42.98 v47.68,42.32
  Bottom 0.203: MICROCONTROLLER1:C2.1 49.14,40.85 v47.68,42.32
GND  (via drill 0.35, 0.65)
  Top 0.203: BREAKOUT1:JP4.4 45.39,34.29 45.19,34.09 | POWER1:C10.C 78,51.66 POWER1:LED1.C | 76.52,49 POWER1:C12.2 | 76.52,49 77.6,50.08 POWER1:C10.C | 76.46,46.4 MICROCONTROLLER1:C4.2 | 76.46,46.4 76.52,46.46 76.52,49 | 76.46,46.4 77.16,46.4 77.87,47.11 79.18,47.11 79.33,46.96 79.33,45.75 78.83,45.24 78.83,42.63 78.63,42.44 | POWER1:JP1.1 84.82,42.55 84.95,42.41 | 84.95,42.41 POWER1:JP6.1 85.09,41.66 86.07,40.68 86.07,39.87 85.01,38.81 82.06,38.81 81.36,39.51 81.36,39.71 78.63,42.44 | BICYCLE_MODULE1:Q1.3 75.15,42.55 76.34,43.74 77.33,43.74 78.63,42.44 | POWER1:C10.C 77.93,52.07 | 46.01,44.83 MICROCONTROLLER1:U2.20 | 46.01,45.38 46.01,46.01 47.84,47.84 | 46.01,45.38 46.01,44.83 | MICROCONTROLLER1:U2.24 48.01,44.76 47.93,44.83 46.01,44.83 | MICROCONTROLLER1:U2.10 43.8,47.47 45.57,47.47 45.31,47.73 45.31,48.18 | 45.31,48.18 45.31,49.12 45.2,49.01 44.73,49.01 | 47.84,47.84 MICROCONTROLLER1:U2.65 | MICROCONTROLLER1:U2.65 48.18,48.18 45.31,48.18 | MICROCONTROLLER1:U2.65 51.01,45.51 MICROCONTROLLER1:U2.35 | MICROCONTROLLER1:U2.45 52.7,50.57 48.95,50.57 | 48.95,50.57 49.01,50.64 49.01,51.44 | 49.01,51.44 MICROCONTROLLER1:U2.55 | 47.84,51.66 47.84,52.03 47.51,52.36 MICROCONTROLLER1:U2.58 | 46.01,50.8 46.01,50.61 | 46.01,50.61 46.1,50.52 | 59.92,49.48 LEDS1:LED3.C | 59.92,49.48 LEDS1:LED2.C 59.97,49.53 | 59.97,49.53 v61.21,49.53 | 59.97,49.53 59.92,49.48 | v59.11,36.37 59.05,36.42 PROGRAMMING1:J1.6 | POWER1:C10.C 77.6,53.65 v77.65,53.7 | MICROCONTROLLER1:C6.2 MICROCONTROLLER1:C5.2 MICROCONTROLLER1:C1.2 37.67,56.73 37.32,57.07 33.8,57.07 33.1,56.37 33.1,55.39 34.29,54.19 BICYCLE_MODULE1:LED3.C BICYCLE_MODULE1:LED2.C 34.68,50.79 33.48,50.79 31.7,49
  Top 0.203: ANTENNA1:C9.1 40.85,42.63 39.67,42.63 36.27,39.23 36.27,38.24 37.34,37.17 | BREAKOUT1:JP4.3 42.33,34.29 41.13,33.1 40.15,33.1 39.45,33.8 39.45,34.78 | 39.45,34.78 39.45,35.84 38.11,37.17 37.34,37.17 | 44.73,49.01 MICROCONTROLLER1:U2.7 43.08,49.01 42.39,49.7 42.39,50.37 v42.12,50.65 | MICROCONTROLLER1:U2.61 46.01,50.8 | 46.01,50.61 46.01,50.29 | 46.01,50.29 44.73,49.01 | MICROCONTROLLER1:U2.65 48.26,51.24 47.84,51.66 | MICROCONTROLLER1:U2.65 48.26,49.89 48.95,50.57 | MICROCONTROLLER1:U2.45 49.94,50.51 49.01,51.44 | MICROCONTROLLER1:U2.45 46.23,50.51 46.01,50.29 | v41.88,38.8 42.25,38.43 44.15,38.43 44.33,38.25 44.33,37.04 44.18,36.89 41.55,36.89 39.45,34.78 | 31.7,49 31.7,42.47 31.98,42.19 v31.98,41.27 33.24,41.27 33.73,40.78 33.73,38.24 34.8,37.17 37.34,37.17 | 47.84,51.66 47.84,47.84 | 47.84,47.21 46.01,45.38 | 31.7,49 31.59,48.9 BICYCLE_MODULE1:D3.K | BICYCLE_MODULE1:D2.K 86.64,45.37 86.64,45.27 84.95,43.59 84.95,42.41 | MICROCONTROLLER1:U2.65 48.26,48.55 46.01,50.8 | 69.16,52.7 PROGRAMMING1:JP9.GND 68.71,52.58 69.29,52.58 69.16,52.7
  Bottom 0.203: POWER1:C14.C 80.78,42.55 POWER1:JP1.1 | 45.67,34.29 BREAKOUT1:JP4.3 | BREAKOUT1:JP4.4 45.67,34.29 | BREAKOUT1:SJ2.1 45.72,38.86 45.72,39.14 | 45.72,39.14 MICROCONTROLLER1:C7.2 | v61.21,49.53 61.85,48.9 POWER1:R4.1 62.65,50.59 62.87,50.8 65.23,50.8 65.41,50.98 66.85,50.98 PROGRAMMING1:JP9.GND 69.97,54.09 71.75,54.09 | 59.99,35.48 v59.11,36.37 | 59.99,35.48 61.45,35.48 62.85,34.09 BREAKOUT1:U$2.10 67.61,34.09 68.58,35.05 79.28,35.05 83.74,39.51 83.74,40.93 POWER1:JP6.1 | v77.65,53.7 77.2,53.7 76.39,52.89 75.86,52.89 75.41,53.34 POWER1:C13.2 73.03,53.55 73.03,53.98 72.91,54.09 71.75,54.09 | 40.85,51.38 ANTENNA1:C11.2 | 37.13,45.11 37.02,45.23 | v31.98,41.27 35.81,45.11 37.13,45.11 | 37.13,45.11 37.74,44.5 38.71,44.5 39.96,45.75 39.96,49.69 40.85,50.58 40.85,51.38 | v42.12,50.65 41.38,51.38 40.85,51.38 | MICROCONTROLLER1:C7.2 46.22,39.16 47.02,39.96 48.23,39.96 49.03,39.16 MICROCONTROLLER1:C2.2 | MICROCONTROLLER1:C8.2 43.19,39.14 45.72,39.14 | MICROCONTROLLER1:C7.2 MICROCONTROLLER1:C8.2 | MICROCONTROLLER1:C8.2 42.82,38.8 v41.88,38.8 | 46.86,35.48 59.99,35.48 | 46.86,35.48 45.67,34.29 | BREAKOUT1:SJ1.1 46.86,35.48 | ANTENNA1:B1.5 36.75,45.49 37.13,45.11 | 72.31,53.98 72.19,54.09 71.75,54.09
  other vias: 59.05,56.52 62.23,56.52 64.14,41.91 64.14,37.47 71.75,36.83 85.09,36.83 80.64,53.98 33.66,47.62 36.83,41.91 49.53,50.8 50.8,50.8 48.26,50.8 46.99,50.8 45.72,50.8 46.35,49.53 47.62,49.53 48.26,48.26 48.9,49.53 50.16,49.53 45.72,48.26 46.99,48.26 49.53,48.26 50.8,48.26 50.16,46.99 48.9,46.99 47.62,46.99 46.35,46.99 46.99,45.72 45.72,45.72 48.26,45.72 49.53,45.72 50.8,45.72 66.67,36.83 66.04,46.35 33.66,36.2 80.01,38.1
  pour Top: 33.02,59.69 87,59.69 87,29.84 31.75,29.84 31.75,59.69
  pour Bottom: 85.72,60.33 31.75,60.33 31.75,30.48 87,30.48 87,60.33
LEDS1:N$65  (via drill 0.35)
  Top 0.203: LEDS1:LED3.A 56.95,47.02 v58.45,47.02
  Bottom 0.203: v58.45,47.02 57.09,47.02 LEDS1:R5.1
LEDS1:N$66  (via drill 0.35)
  Top 0.203: v58.34,49.51 58.32,49.53 LEDS1:LED2.A
  Bottom 0.203: LEDS1:R6.1 58.27,49.43 v58.34,49.51
MICROCONTROLLER1:N$57  (via drill 0.35)
  Top 0.203: MICROCONTROLLER1:U2.57 48.01,53.56 47.88,53.7 47.07,53.7 46.54,54.23 44.48,54.23 43.68,55.03 MICROCONTROLLER1:C5.1 43.44,55.93 45.69,55.93 45.84,56.08 45.84,56.63 v46.35,57.15
  Bottom 0.203: MICROCONTROLLER1:Y1.3 42.54,57.03 43.34,57.83 45.45,57.83 46.13,57.15 v46.35,57.15
MICROCONTROLLER1:N$58  (via drill 0.35)
  Top 0.203: MICROCONTROLLER1:C6.1 46.24,55.03 47.22,54.05 48.13,54.05 48.41,53.77 | MICROCONTROLLER1:U2.56 48.51,53.67 48.41,53.77 | 48.41,53.77 48.82,54.18 v49.02,54.18
  Bottom 0.203: v49.02,54.18 44.94,54.18 MICROCONTROLLER1:Y1.1
MICROCONTROLLER1:N$59  (via drill 0.35)
  Top 0.203: MICROCONTROLLER1:U2.18 45.01,42.37 v44.88,42.24 MICROCONTROLLER1:Y2.X1
  Bottom 0.203: MICROCONTROLLER1:C7.1 45.72,41.4 v44.88,42.24
MICROCONTROLLER1:N$60  (via drill 0.35)
  Top 0.203: 42.82,38.07 MICROCONTROLLER1:Y2.X2 42.72,37.54 39.51,37.54 38.81,38.24 38.81,39.23 39.51,39.93 40.06,39.93 v42.6,42.47 43.22,42.47 MICROCONTROLLER1:U2.17
  Bottom 0.203: v42.6,42.47 43.18,41.88 MICROCONTROLLER1:C8.1
MISO
  Top 0.203: MICROCONTROLLER1:U2.39 53.75,47.51 54.56,46.7 54.56,45.59 56.33,43.81 PROGRAMMING1:J1.1 57.86,42.47 59.55,42.47 60.96,41.06 BREAKOUT1:JP8.2
MOSI
  Top 0.203: MICROCONTROLLER1:U2.38 53.49,47.01 54.2,46.3 54.2,45.44 55.24,44.4 55.24,42.85 55.47,42.62 57.15,42.62 58.49,41.27 PROGRAMMING1:J1.4 59.05,40.42 60.25,39.23 60.25,36.12 BREAKOUT1:JP8.1
PB4
  Top 0.152: 60.86,45.14 63.38,42.62 63.38,41.6 69.95,35.02 73.9,35.02 74.84,34.09 BREAKOUT1:U$2.6
  Top 0.203: MICROCONTROLLER1:U2.40 53.98,48.01 55.04,46.94 55.04,46 55.91,45.14 60.86,45.14 64.69,48.97 64.69,53.2 63.54,54.35 57.51,54.35 BREAKOUT1:JP6.4
PB5
  Top 0.203: MICROCONTROLLER1:U2.41 54.51,48.51 55.6,47.42 55.6,46.18 56.08,45.7 60.66,45.7 62.15,47.19 62.15,53.2 61.45,53.9 55.42,53.9 BREAKOUT1:JP6.3
PB6  (via drill 0.35)
  Top 0.203: MICROCONTROLLER1:U2.42 55.23,49.01 v55.96,48.28
  Bottom 0.203: v55.96,48.28 55.96,47.59 LEDS1:R5.2
PB7  (via drill 0.35)
  Top 0.203: MICROCONTROLLER1:U2.43 53.83,49.51 v54.08,49.76
  Bottom 0.203: v54.08,49.76 54.98,49.76 LEDS1:R6.2
PE2
  Top 0.203: BREAKOUT1:JP6.2 51.36,56.01 52.91,54.46 52.91,52.16 MICROCONTROLLER1:U2.48
PE3
  Top 0.203: BREAKOUT1:JP6.1 49.09,56.01 50.28,54.81 51.49,54.81 52.12,54.18 52.12,52.87 MICROCONTROLLER1:U2.49
PG0  (via drill 0.35)
  Top 0.203: MICROCONTROLLER1:U2.14 43.65,45.62 43.26,45.62 42.54,46.33 v42.11,46.33
  Bottom 0.203: v42.11,46.33 41.66,45.88 41.66,45.03 40.39,43.76 37.41,43.76 BREAKOUT1:JP2.1
PG1
  Top 0.203: MICROCONTROLLER1:U2.15 42.2,45.01 BICYCLE_MODULE1:R6.2 40.85,46.02 40.05,45.21 40.05,43.3 39.81,43.06 39.25,43.06 BREAKOUT1:JP2.2
PG2  (via drill 0.35)
  Top 0.203: BREAKOUT1:JP2.3 43.24,44.51 MICROCONTROLLER1:U2.16 42.04,44.51 41.46,45.09 v40.82,45.09
  Bottom 0.203: v40.82,45.09 40.82,46.32 BICYCLE_MODULE1:R5.2
PG5  (via drill 0.35)
  Top 0.203: MICROCONTROLLER1:U2.19 45.62,43.65 45.62,43.26 46.58,42.29 v46.58,42.27 44.33,40.01 44.33,39.58 44.18,39.43 40.7,39.43 BREAKOUT1:JP2.4
  Bottom 0.203: v46.58,42.27 47.32,41.53 47.32,41.51 47.62,41.21 BICYCLE_MODULE1:R1.1
POWER1:FB  (via drill 0.35)
  Top 0.203: v69.62,47.5 69.57,47.55 69.57,47.69 66.92,50.34 v66.24,50.34
  Bottom 0.203: POWER1:R3.1 POWER1:R4.2 65.8,50.34 v66.24,50.34 | v69.62,47.5 70.92,47.5 POWER1:U3.1
POWER1:N$61
  Top 0.203: POWER1:LED1.A 80.64,46.77 POWER1:R2.1
POWER1:N$67
  Top 0.203: POWER1:S2.2 83.34,48.74 82.34,47.73 82.34,44.02 81.36,43.04 81.36,41.2 POWER1:JP1.2 84.82,40.01 POWER1:JP6.2
PROGRAMMING1:DTR
  Bottom 0.203: PROGRAMMING1:C15.1 53.11,40.45 51.67,40.45 51.3,40.82 51.3,41.34 53.34,43.39 53.34,50.16 PROGRAMMING1:JP9.DTR
RESET  (via drill 0.35)
  Top 0.203: MICROCONTROLLER1:U2.12 43.18,46.51 v41.99,47.7
  Bottom 0.203: MICROCONTROLLER1:R1.1 41.99,47.76 v41.99,47.7 43.69,46 43.69,43.56 44.3,42.95 48.85,42.95 50.94,40.85 50.94,40.67 53.09,38.52 PROGRAMMING1:C15.2 56.3,38.52 PROGRAMMING1:J1.5
RFN
  Top 0.203: ANTENNA1:C17.2 41.06,48.69 42.4,48.69 43.07,48.01 MICROCONTROLLER1:U2.9
RFP
  Top 0.203: MICROCONTROLLER1:U2.8 43.08,48.51 40.85,50.73 ANTENNA1:C16.1
RX0
  Top 0.203: MICROCONTROLLER1:U2.46 59.27,51.01 PROGRAMMING1:JP9.TXO
RX1
  Top 0.152: 80.52,33.1 82.52,33.1 BREAKOUT1:U$2.2
  Top 0.203: MICROCONTROLLER1:U2.27 49.51,43.36 50.12,42.75 50.38,42.49 52.82,42.49 53.6,41.71 53.6,34.55 BREAKOUT1:JP1.1 54.53,33.1 80.52,33.1
SCK
  Top 0.203: MICROCONTROLLER1:U2.37 53.39,46.51 53.85,46.05 53.85,45.29 54.85,44.29 54.85,42.74 55.32,42.27 55.52,42.27 PROGRAMMING1:J1.3
SCL
  Top 0.203: MICROCONTROLLER1:U2.25 48.51,43.18 49.92,41.77 52.13,41.77 52.63,41.27 52.63,37.06 51.05,35.48 50.31,35.48 49.11,34.29 BREAKOUT1:JP7.2
SDA
  Top 0.203: MICROCONTROLLER1:U2.26 49.01,43.35 49.97,42.4 50.24,42.13 52.67,42.13 52.98,41.82 52.98,36.47 BREAKOUT1:JP7.1
TST  (via drill 0.35)
  Top 0.203: MICROCONTROLLER1:U2.11 43.18,47.01 42.62,47.57 42.62,47.96 42.25,48.33 41.72,48.33 40.5,47.11 40.2,47.11 40.04,46.95 40.04,45.83 39.81,45.6 39.36,45.6 38.26,44.5 36.55,44.5 v36.52,44.48
  Bottom 0.203: BREAKOUT1:SJ2.2 42.65,36.85 35.8,36.85 33.24,34.29 BREAKOUT1:JP5.2 31.19,35.48 31.19,39.78 31.58,40.17 32.22,40.17 v36.52,44.48
TX0
  Top 0.203: PROGRAMMING1:JP9.RXI 57.57,52.7 56.37,51.51 MICROCONTROLLER1:U2.47
TX1
  Top 0.203: MICROCONTROLLER1:U2.28 50.01,43.36 50.27,43.11 50.46,42.91 52.89,42.91 53.95,41.86 53.95,36.22 BREAKOUT1:JP1.2
  Bottom 0.152: BREAKOUT1:U$2.3 80.52,33.1 79.38,33.1
  Bottom 0.203: BREAKOUT1:JP1.2 57.07,33.1 79.38,33.1
VCC  (via drill 0.35)
  Top 0.203: v82.5,53.03 82.5,52.62 POWER1:S2.1
  Bottom 0.203: POWER1:U3.3 70.64,50.01 68.4,50.01 67.31,48.92 BICYCLE_MODULE1:LS1.+ 67.31,43.45 66.17,42.31 66.17,41.36 66.84,40.69 67.78,40.69 69.12,42.03 BICYCLE_MODULE1:D1.C 73.07,39.45 78.95,39.45 POWER1:C14.A | POWER1:C13.1 71.83,53.05 POWER1:U3.3 | POWER1:U3.3 80.67,51.21 v82.5,53.03